# EAGLE design schema (EAGLE 7.3.0)

## Sheet 1 of 3
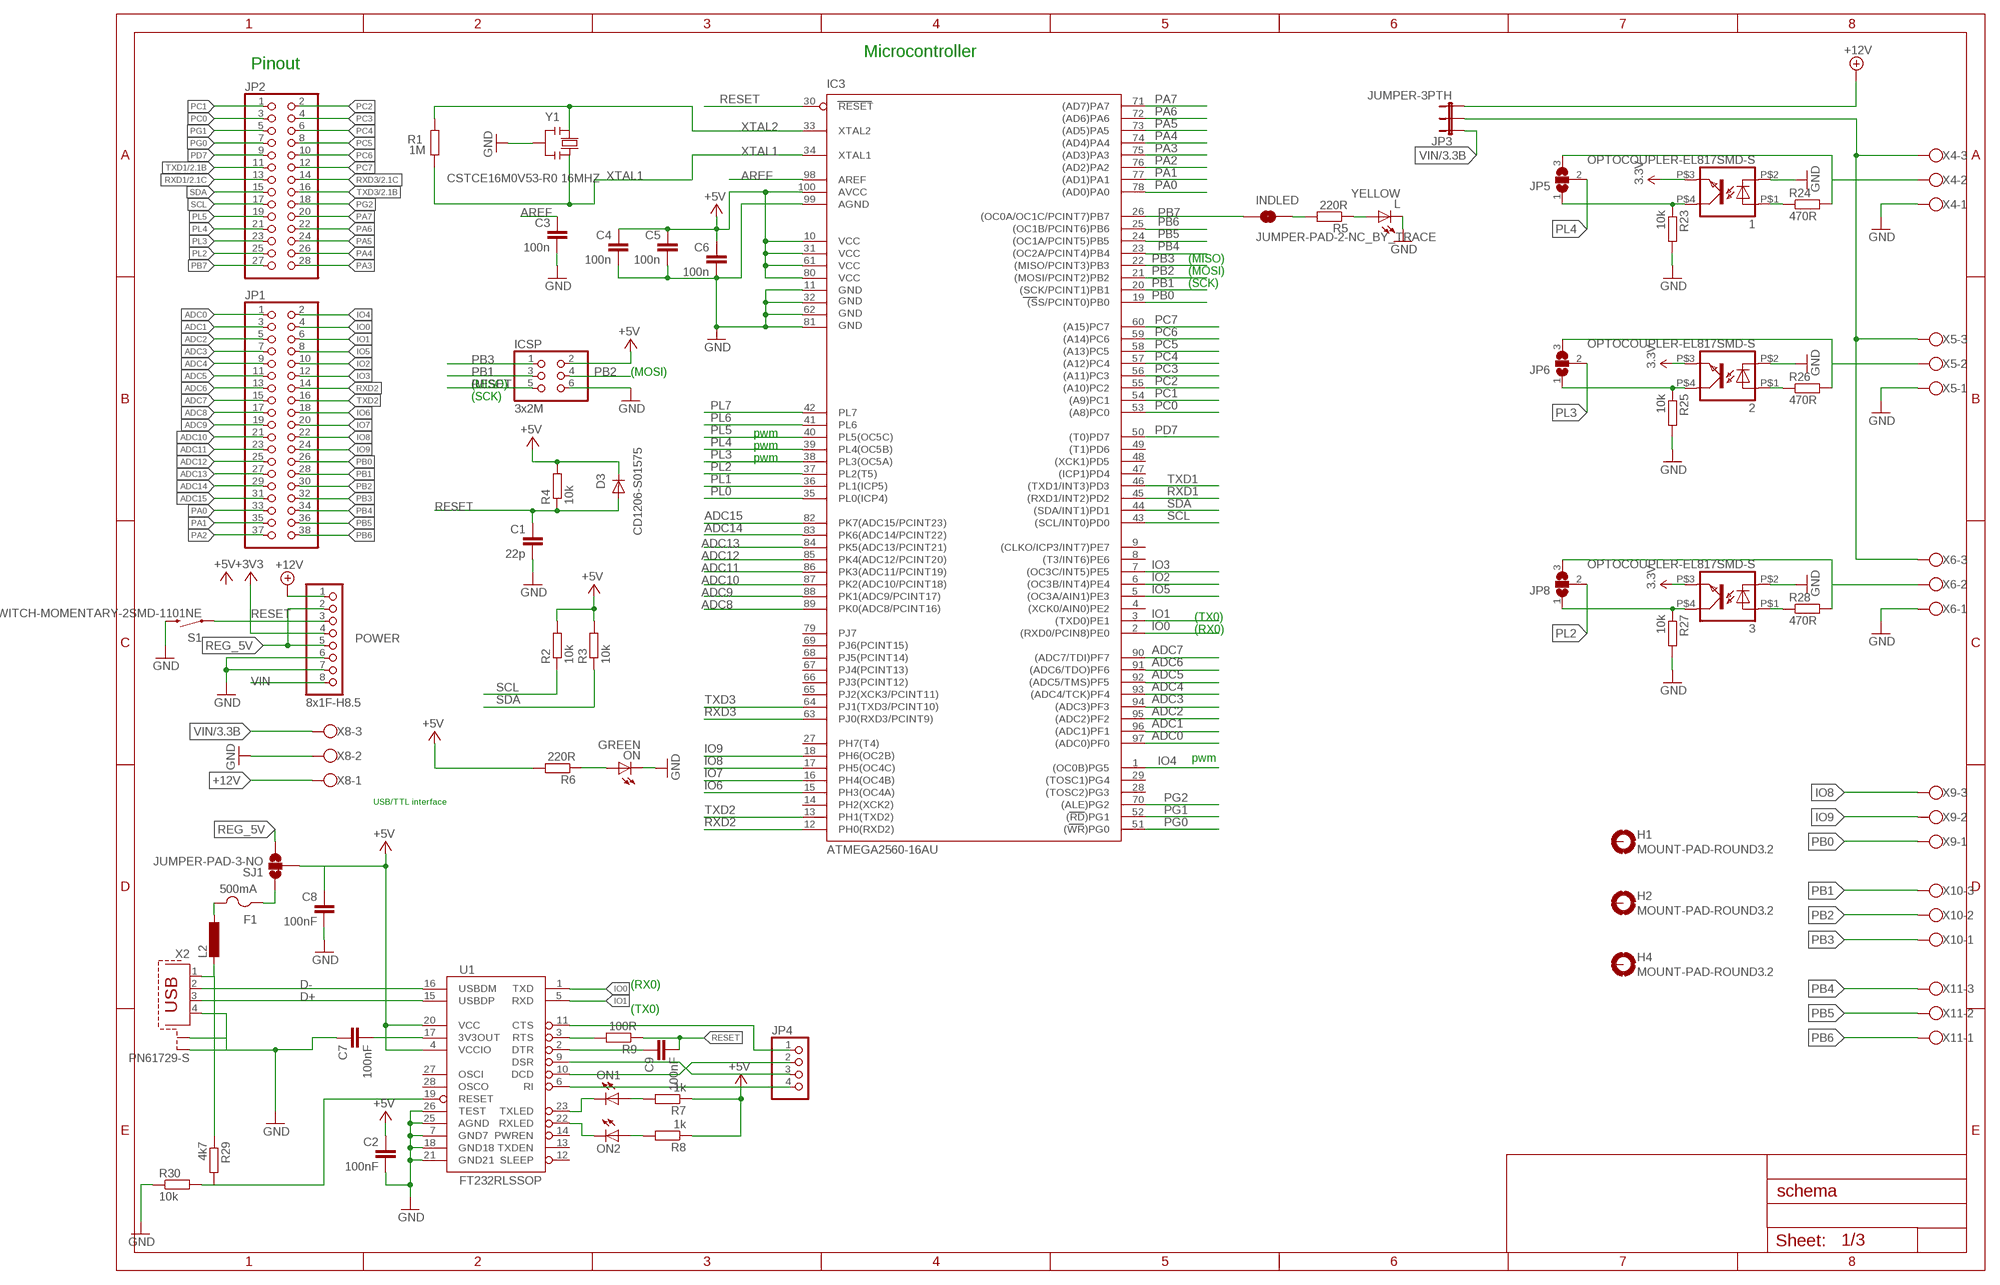
[diagram p0: schematic, sheet 1]

### Parts
1  OPTOCOUPLER-EL817SMD-S  [SMD-S]
2  OPTOCOUPLER-EL817SMD-S  [SMD-S]
3  OPTOCOUPLER-EL817SMD-S  [SMD-S]
C1  22p  C-EU0603-RND  [C0603-ROUND]
C2  100nF  C-EU0603-RND  [C0603-ROUND]
C3  100n  C-EU0603-RND  [C0603-ROUND]
C4  100n  C-EU0603-RND  [C0603-ROUND]
C5  100n  C-EU0603-RND  [C0603-ROUND]
C6  100n  C-EU0603-RND  [C0603-ROUND]
C7  100nF  C-EU0603-RND  [C0603-ROUND]
C8  100nF  C-EU0603-RND  [C0603-ROUND]
C9  100nF  C-EU0603-RND  [C0603-ROUND]
D3  CD1206-S01575  DIODE-MINIMELF  [MINIMELF]
F1  500mA  PTCFUSE-1812  [1812]
H1  MOUNT-PAD-ROUND3.2  [3,2-PAD]
H2  MOUNT-PAD-ROUND3.2  [3,2-PAD]
H4  MOUNT-PAD-ROUND3.2  [3,2-PAD]
IC3  ATMEGA2560-16AU  ATMEGA25602560-16AU  [TQFP100]
ICSP  3x2M  PINHD-2X3  [2X03]
INDLED  JUMPER-PAD-2-NC_BY_TRACE  [PAD-JUMPER-2-NC_BY_TRACE_YES_SILK]
JP1  PINHD-2X19  [2X19]
JP2  PINHD-2X14  [2X14]
JP3  JUMPER-3PTH  [1X03]
JP4  PINHD-1X4  [1X04]
JP5  SJ2W  [SJ_2]
JP6  SJ2W  [SJ_2]
JP8  SJ2W  [SJ_2]
L  YELLOW  LEDCHIP-LED0805  [CHIP-LED0805]
L2  L-EUL1812  [L1812]
ON  GREEN  LEDCHIP-LED0805  [CHIP-LED0805]
ON1  GREEN  LEDCHIP-LED0805  [CHIP-LED0805]
ON2  GREEN  LEDCHIP-LED0805  [CHIP-LED0805]
POWER  8x1F-H8.5  PINHD-1X8  [1X08]
R1  1M  R-EU_R0603  [R0603-ROUND]
R2  10k  R-EU_R0603  [R0603]
R3  10k  R-EU_R0603  [R0603]
R4  10k  R-EU_R0603  [R0603]
R5  220R  R-EU_R0603  [R0603]
R6  220R  R-EU_R0603  [R0603]
R7  1k  R-EU_R0603  [R0603]
R8  1k  R-EU_R0603  [R0603]
R9  100R  R-EU_R0603  [R0603]
R23  10k  R-EU_R0603  [R0603]
R24  470R  R-EU_R0603  [R0603]
R25  10k  R-EU_R0603  [R0603]
R26  470R  R-EU_R0603  [R0603]
R27  10k  R-EU_R0603  [R0603]
R28  470R  R-EU_R0603  [R0603]
R29  4k7  R-EU_R0603  [R0603]
R30  10k  R-EU_R0603  [R0603]
S1  SWITCH-MOMENTARY-2SMD-1101NE  [TACTILE-SWITCH-1101NE]
SJ1  JUMPER-PAD-3-NO  [PAD-JUMPER-3-NO_YES_SILK_FULL_BOX_WIDE_SPACING]
U1  FT232RLSSOP  [SSOP28DB]
X2  PN61729-S  [PN61729-S]
X4  W237-103  [W237-103]
X5  W237-103  [W237-103]
X6  W237-103  [W237-103]
X8  W237-103  [W237-103]
X9  W237-103  [W237-103]
X10  W237-103  [W237-103]
X11  W237-103  [W237-103]
Y1  CSTCE16M0V53-R0 16MHZ  RESONATORMU  [RESONATOR]

### Nets
3.3V: 1.P$3 2.P$3 3.P$3 POWER.4 ; supply symbol labelled +3V3 ; also sheet 2,3
+5V [power usb]: C2.1 C4.1 C5.1 C6.1 C8.1 D3.C IC3.10(VCC) IC3.31(VCC1) IC3.61(VCC2) IC3.80(VCC3) IC3.100(AVCC) ICSP.2 R2.2 R3.2 R4.2 R6.2 R7.1 R8.1 SJ1.2 U1.4(VCCIO) U1.20(VCC) ; also sheet 2
+12V: JP3.3 POWER.1 X8.1 ; also sheet 3
ADC0: IC3.97((ADC0)PF0) JP1.1
ADC1: IC3.96((ADC1)PF1) JP1.3
ADC2: IC3.95((ADC2)PF2) JP1.5
ADC3: IC3.94((ADC3)PF3) JP1.7
ADC4: IC3.93((ADC4/TCK)PF4) JP1.9
ADC5: IC3.92((ADC5/TMS)PF5) JP1.11
ADC6: IC3.91((ADC6/TDO)PF6) JP1.13
ADC7: IC3.90((ADC7/TDI)PF7) JP1.15
ADC8: IC3.89(PK0(ADC8/PCINT16)) JP1.17
ADC9: IC3.88(PK1(ADC9/PCINT17)) JP1.19
ADC10: IC3.87(PK2(ADC10/PCINT18)) JP1.21
ADC11: IC3.86(PK3(ADC11/PCINT19)) JP1.23
ADC12: IC3.85(PK4(ADC12/PCINT20)) JP1.25
ADC13: IC3.84(PK5(ADC13/PCINT21)) JP1.27
ADC14: IC3.83(PK6(ADC14/PCINT22)) JP1.29
ADC15: IC3.82(PK7(ADC15/PCINT23)) JP1.31
AREF: C3.1 IC3.98(AREF)
D+: U1.15(USBDP) X2.3
D-: U1.16(USBDM) X2.2
GND [gnd]: 1.P$2 2.P$2 3.P$2 C1.2 C2.2 C3.2 C4.2 C5.2 C6.2 C7.1 C8.2 IC3.11(GND) IC3.32(GND1) IC3.62(GND2) IC3.81(GND3) IC3.99(AGND) ICSP.6 L.C ON.C POWER.6 POWER.7 R23.2 R25.2 R27.2 R30.1 S1.2 U1.7(GND7) U1.18(GND18) U1.21(GND21) U1.25(AGND) U1.26(TEST) X2.4 X2.S1 X2.S2 X4.1 X5.1 X6.1 X8.2 Y1.2 ; also sheet 2,3
IO0: IC3.2((RXD0/PCIN8)PE0) JP1.4 U1.1(TXD)
IO1: IC3.3((TXD0)PE1) JP1.6 U1.5(RXD)
IO2: IC3.6((OC3B/INT4)PE4) JP1.10
IO3: IC3.7((OC3C/INT5)PE5) JP1.12
IO4: IC3.1((OC0B)PG5) JP1.2
IO5: IC3.5((OC3A/AIN1)PE3) JP1.8
IO6: IC3.15(PH3(OC4A)) JP1.18
IO7: IC3.16(PH4(OC4B)) JP1.20
IO8: IC3.17(PH5(OC4C)) JP1.22 X9.3
IO9: IC3.18(PH6(OC2B)) JP1.24 X9.2
N$1: L.A R5.1
N$2: ON1.A R7.2
N$3: ON.A R6.1
N$4: ON2.A R8.2
N$5: C7.2 U1.17(3V3OUT)
N$6: L2.2 R29.1 X2.1
N$7: ON1.C U1.23(TXLED)
N$8: ON2.C U1.22(RXLED)
N$9: R9.2 U1.3(RTS)
N$10: C9.1 U1.2(DTR)
N$11: JP4.1 U1.11(CTS)
N$12: JP4.2 U1.10(DCD)
N$13: JP4.3 U1.9(DSR)
N$14: JP4.4 U1.6(RI)
N$31: INDLED.2 R5.2
N$32: F1.2 L2.1
N$33: JP3.2 X4.3 X5.3 X6.3
N$34: 2.P$4 JP6.1 R25.1
N$35: 1.P$4 JP5.1 R23.1
N$36: JP5.3 R24.2 X4.2
N$37: 1.P$1 R24.1
N$39: JP6.3 R26.2 X5.2
N$40: 2.P$1 R26.1
N$41: R29.2 R30.2 U1.19(RESET)
N$42: 3.P$4 JP8.1 R27.1
N$43: JP8.3 R28.2 X6.2
N$44: 3.P$1 R28.1
PA0: IC3.78((AD0)PA0) JP1.33
PA1: IC3.77((AD1)PA1) JP1.35
PA2: IC3.76((AD2)PA2) JP1.37
PA3: IC3.75((AD3)PA3) JP2.28
PA4: IC3.74((AD4)PA4) JP2.26
PA5: IC3.73((AD5)PA5) JP2.24
PA6: IC3.72((AD6)PA6) JP2.22
PA7: IC3.71((AD7)PA7) JP2.20
PB0: IC3.19((SS/PCINT0)PB0) JP1.26 X9.1
PB1: IC3.20((SCK/PCINT1)PB1) ICSP.3 JP1.28 X10.3
PB2: IC3.21((MOSI/PCINT2)PB2) ICSP.4 JP1.30 X10.2
PB3: IC3.22((MISO/PCINT3)PB3) ICSP.1 JP1.32 X10.1
PB4: IC3.23((OC2A/PCINT4)PB4) JP1.34 X11.3
PB5: IC3.24((OC1A/PCINT5)PB5) JP1.36 X11.2
PB6: IC3.25((OC1B/PCINT6)PB6) JP1.38 X11.1
PB7: IC3.26((OC0A/OC1C/PCINT7)PB7) INDLED.1 JP2.27
PC0: IC3.53((A8)PC0) JP2.3
PC1: IC3.54((A9)PC1) JP2.1
PC2: IC3.55((A10)PC2) JP2.2
PC3: IC3.56((A11)PC3) JP2.4
PC4: IC3.57((A12)PC4) JP2.6
PC5: IC3.58((A13)PC5) JP2.8
PC6: IC3.59((A14)PC6) JP2.10
PC7: IC3.60((A15)PC7) JP2.12
PD7: IC3.50((T0)PD7) JP2.9
PG0: IC3.51((WR)PG0) JP2.7
PG1: IC3.52((RD)PG1) JP2.5
PG2: IC3.70((ALE)PG2) JP2.18
PL0: IC3.35(PL0(ICP4))
PL1: IC3.36(PL1(ICP5))
PL2: IC3.37(PL2(T5)) JP2.25 JP8.2
PL3: IC3.38(PL3(OC5A)) JP2.23 JP6.2
PL4: IC3.39(PL4(OC5B)) JP2.21 JP5.2
PL5: IC3.40(PL5(OC5C)) JP2.19
PL6: IC3.41(PL6)
PL7: IC3.42(PL7)
REG_5V: POWER.2 POWER.5 SJ1.3 ; also sheet 3
RESET: C1.1 C9.2 D3.A IC3.30(RESET) ICSP.5 POWER.3 R4.1 R9.1 S1.1
RXD1: IC3.45((RXD1/INT2)PD2) JP2.13 ; also sheet 2
RXD2: IC3.12(PH0(RXD2)) JP1.14
RXD3: IC3.63(PJ0(RXD3/PCINT9)) JP2.14 ; also sheet 2
SCL: IC3.43((SCL/INT0)PD0) JP2.17 R2.1
SDA: IC3.44((SDA/INT1)PD1) JP2.15 R3.1
TXD1: IC3.46((TXD1/INT3)PD3) JP2.11 ; also sheet 2
TXD2: IC3.13(PH1(TXD2)) JP1.16
TXD3: IC3.64(PJ1(TXD3/PCINT10)) JP2.16 ; also sheet 2
VIN [power]: JP3.1 POWER.8 X8.3 ; also sheet 3
VUSB: F1.1 SJ1.1
XTAL1: IC3.34(XTAL1) R1.1 Y1.3
XTAL2: IC3.33(XTAL2) R1.2 Y1.1
Unconnected: H1.B3,2(MOUNT) H2.B3,2(MOUNT) H4.B3,2(MOUNT) IC3.4((XCK0/AIN0)PE2) IC3.8((T3/INT6)PE6) IC3.9((CLKO/ICP3/INT7)PE7) IC3.14(PH2(XCK2)) IC3.27(PH7(T4)) IC3.28((TOSC2)PG3) IC3.29((TOSC1)PG4) IC3.47((ICP1)PD4) IC3.48((XCK1)PD5) IC3.49((T1)PD6) IC3.65(PJ2(XCK3/PCINT11)) IC3.66(PJ3(PCINT12)) IC3.67(PJ4(PCINT13)) IC3.68(PJ5(PCINT14)) IC3.69(PJ6(PCINT15)) IC3.79(PJ7) U1.12(SLEEP) U1.13(TXDEN) U1.14(PWREN) U1.27(OSCI) U1.28(OSCO)

### Notes on the sheet
- Microcontroller
- Pinout
- (MISO)
- (MOSI)
- (SCK)
- (MOSI)
- (MISO)
- (SCK)
- pwm
- pwm
- pwm
- (TX0)
- (RX0)
- pwm
- USB/TTL interface
- (RX0)
- (TX0)

## Sheet 2 of 3
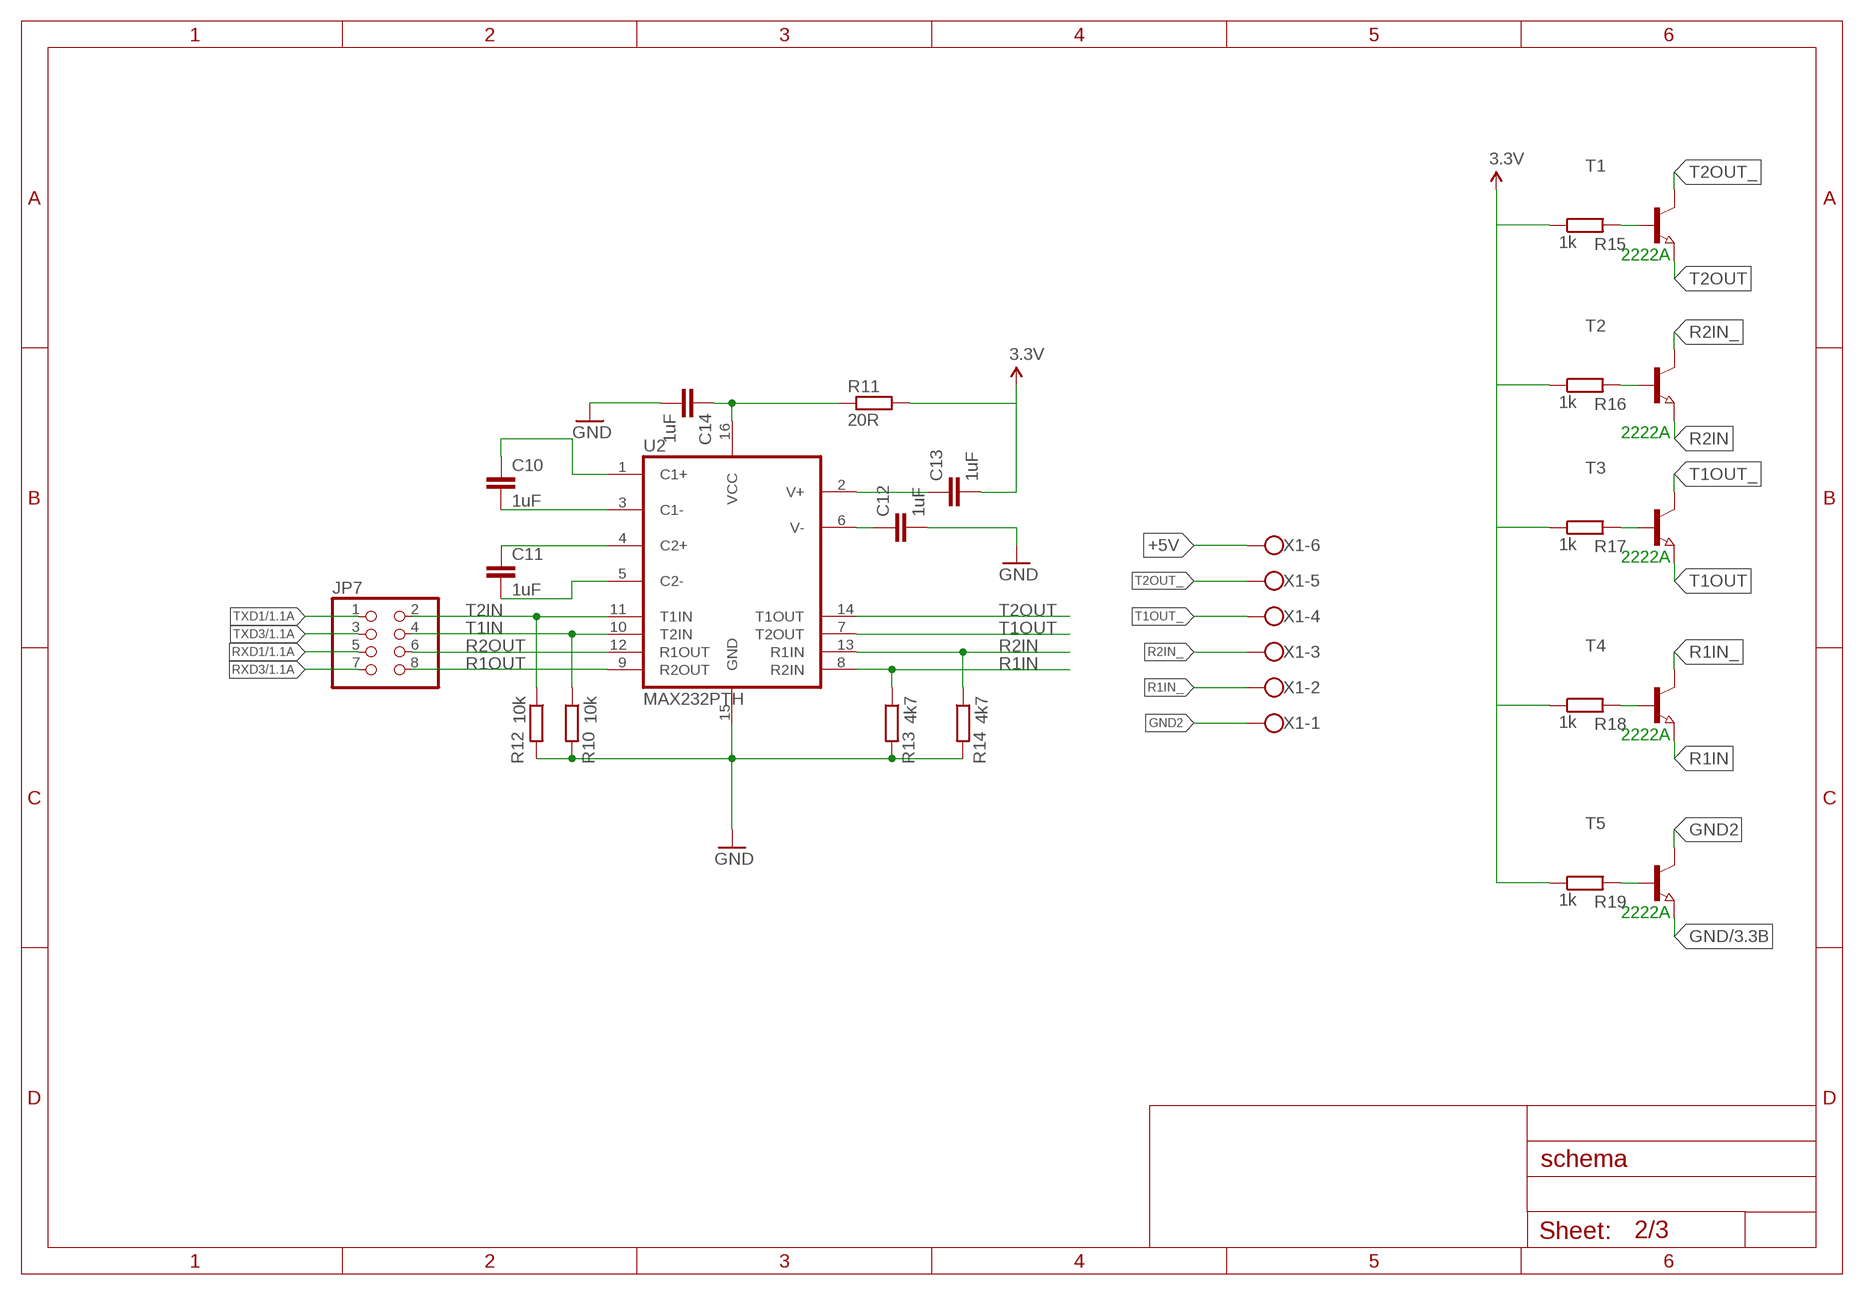
[diagram p1: schematic, sheet 2]

### Parts
C10  1uF  C-EUC0603  [C0603]
C11  1uF  C-EUC0603  [C0603]
C12  1uF  C-EUC0603  [C0603]
C13  1uF  C-EUC0603  [C0603]
C14  1uF  C-EUC0603  [C0603]
JP7  PINHD-2X4  [2X04]
R10  10k  R-EU_R0603  [R0603]
R11  20R  R-EU_R0603  [R0603]
R12  10k  R-EU_R0603  [R0603]
R13  4k7  R-EU_R0603  [R0603]
R14  4k7  R-EU_R0603  [R0603]
R15  1k  R-EU_R0603  [R0603]
R16  1k  R-EU_R0603  [R0603]
R17  1k  R-EU_R0603  [R0603]
R18  1k  R-EU_R0603  [R0603]
R19  1k  R-EU_R0603  [R0603]
T1  NPN-TRANSISTOR_SOT23  [SOT23]
T2  NPN-TRANSISTOR_SOT23  [SOT23]
T3  NPN-TRANSISTOR_SOT23  [SOT23]
T4  NPN-TRANSISTOR_SOT23  [SOT23]
T5  NPN-TRANSISTOR_SOT23  [SOT23]
U2  MAX232PTH  [DIL16]
X1  W237-6  [W237-6]

### Nets
3.3V: C13.2 R11.2 R15.1 R16.1 R17.1 R18.1 R19.1 ; also sheet 1,3
+5V [power usb]: X1.6 ; also sheet 1
GND [gnd]: C12.2 C14.2 R10.2 R12.2 R13.2 R14.2 T5.2(E) U2.15(GND) ; also sheet 1,3
GND2: T5.3(C) X1.1
N$15: C10.2 U2.3(C1-)
N$16: C10.1 U2.1(C1+)
N$17: C11.2 U2.5(C2-)
N$18: C11.1 U2.4(C2+)
N$19: C12.1 U2.6(V-)
N$20: C14.1 R11.1 U2.16(VCC)
N$21: C13.1 U2.2(V+)
N$22: R15.2 T1.1(B)
N$23: R16.2 T2.1(B)
N$24: R17.2 T3.1(B)
N$25: R18.2 T4.1(B)
N$26: R19.2 T5.1(B)
R1IN: R13.1 T4.2(E) U2.8(R2IN)
R1IN_: T4.3(C) X1.2
R1OUT: JP7.8 U2.9(R2OUT)
R2IN: R14.1 T2.2(E) U2.13(R1IN)
R2IN_: T2.3(C) X1.3
R2OUT: JP7.6 U2.12(R1OUT)
RXD1: JP7.5 ; also sheet 1
RXD3: JP7.7 ; also sheet 1
T1IN: JP7.4 R10.1 U2.10(T2IN)
T1OUT: T3.2(E) U2.7(T2OUT)
T1OUT_: T3.3(C) X1.4
T2IN: JP7.2 R12.1 U2.11(T1IN)
T2OUT: T1.2(E) U2.14(T1OUT)
T2OUT_: T1.3(C) X1.5
TXD1: JP7.1 ; also sheet 1
TXD3: JP7.3 ; also sheet 1

### Notes on the sheet
- 2222A
- 2222A
- 2222A
- 2222A
- 2222A

## Sheet 3 of 3
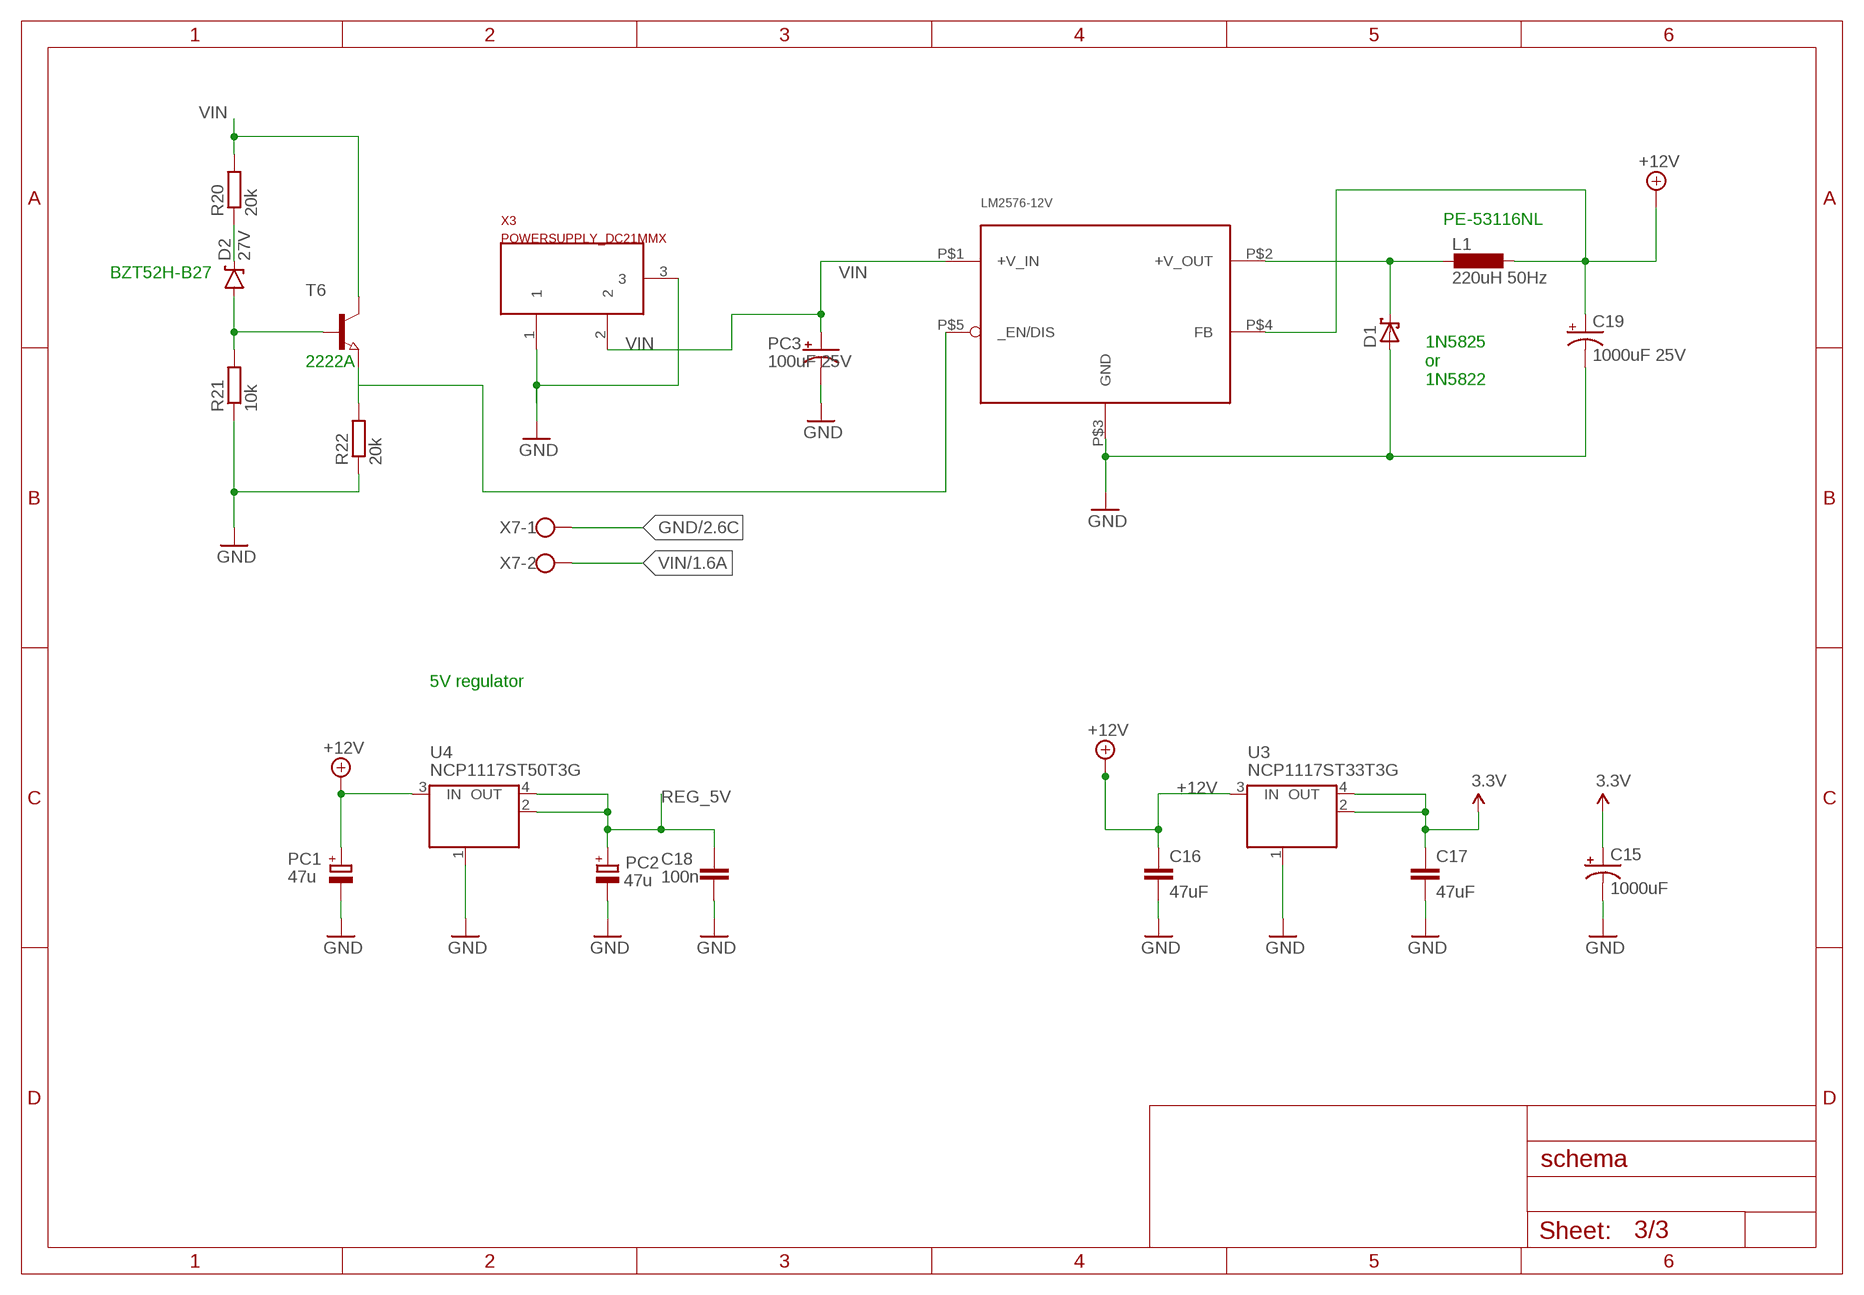
[diagram p2: schematic, sheet 3]

### Parts
C15  1000uF  CPOL-USE5-6  [E5-6]
C16  47uF  C-EUC0603  [C0603]
C17  47uF  C-EUC0603  [C0603]
C18  100n  C-EU0603-RND  [C0603-ROUND]
C19  1000uF 25V  CPOL-USE5-6  [E5-6]
D1  1N5908  [C4111-15]
D2  27V  DIODE-ZENER16V  [SOD-123]
L1  220uH 50Hz  L-KM4.0  [KM-4.0]
LM2576-12V  LM2576-T05D  [TO220-5_STAGGERED]
PC1  47u  CPOL-EUD  [PANASONIC_D]
PC2  47u  CPOL-EUD  [PANASONIC_D]
PC3  100uF 25V  CPOL-USE5-6  [E5-6]
R20  20k  R-EU_R0603  [R0603]
R21  10k  R-EU_R0603  [R0603]
R22  20k  R-EU_R0603  [R0603]
T6  NPN-TRANSISTOR_SOT23  [SOT23]
U3  NCP1117ST33T3G  MC33269ST-3.3T3  [SOT223]
U4  NCP1117ST50T3G  MC33269ST-3.3T3  [SOT223]
X3  POWERSUPPLY_DC21MMX  [POWERSUPPLY_DC-21MM]
X7  W237-102  [W237-102]

### Nets
3.3V: C15.+ C17.1 U3.2(OUT) U3.4(OUT) ; also sheet 1,2
+12V: C16.1 C19.+ L1.P$2 LM2576-12V.P$4(FB) PC1.+ U3.3(IN) U4.3(IN) ; also sheet 1
GND [gnd]: C15.- C16.2 C17.2 C18.1 C19.- D1.A LM2576-12V.P$3(GND) PC1.- PC2.- PC3.- R21.1 R22.1 U3.1(GND/ADJ) U4.1(GND/ADJ) X3.1 X3.3 X7.1 ; also sheet 1,2
N$27: D1.C L1.P$1 LM2576-12V.P$2(+V_OUT)
N$28: D2.A R21.2 T6.1(B)
N$29: D2.C R20.1
N$30 [gnd]: LM2576-12V.P$5(_EN/DIS) R22.2 T6.2(E)
REG_5V: C18.2 PC2.+ U4.2(OUT) U4.4(OUT) ; also sheet 1
VIN [power]: LM2576-12V.P$1(+V_IN) PC3.+ R20.2 T6.3(C) X3.2 X7.2 ; also sheet 1

### Notes on the sheet
- PE-53116NL
- BZT52H-B27
- 2222A
- 1N5825
  or
  1N5822
- 5V regulator

## Library data of the parts
1-3 = EL817:OPTOCOUPLER-EL817
C1-C9 C18 = SmartPrj:C-EU: CAPACITOR, European symbol
C10-C14 C16 C17 = rcl:C-EU: CAPACITOR, European symbol
C15 C19 PC3 = adafruit:CPOL-US: POLARIZED CAPACITOR, American symbol
D1 = diode:1N5908: DIODE schottky
D2 = SparkFun-DiscreteSemi:DIODE-ZENER: Zener Diode Production Part - 8199 3.4V Zener Voltage; PROD_ID: DIO-12440; VALUE: 16V
D3 = diode:DIODE-: DIODE
F1 = adafruit:PTCFUSE: PTC fuses, resettable thermistors
H1 H2 H4 = holes:MOUNT-PAD-ROUND: MOUNTING PAD, round
IC3 = SmartPrj:ATMEGA2560: MICROCONTROLLER 64/128/256 Kbytes FLASH 4 Kbytes EEPROM 8 Kbytes SRAM 86 General Purpose I/O pins 12-channels16-bit PWM 4 x Serial USARTs 16-channels 10-bit A/D
ICSP = SmartPrj:PINHD-2X3: PIN HEADER
INDLED = SparkFun-Passives:JUMPER-PAD-2-NC_BY_TRACE
JP1 = pinhead:PINHD-2X19: PIN HEADER
JP2 = pinhead:PINHD-2X14: PIN HEADER
JP3 = SparkFun-Retired:JUMPER-3
JP4 = pinhead:PINHD-1X4: PIN HEADER
JP5 JP6 JP8 = jumper:SJ2W: SMD solder JUMPER
JP7 = adafruit:PINHD-2X4: PIN HEADER
L ON ON1 ON2 = led:LED: LED OSRAM: - CHIPLED LG R971, LG N971, LY N971, LG Q971, LY Q971, LO R971, LY R971 LH N974, LH R974 LS Q976, LO Q976, LY Q976 LO Q996 - Hyper CHIPLED LW Q18S LB Q993, LB Q99A, LB R99A - SideLED LS A670, LO A670, LY A670, LG A670, LP A670 LB A673, LV A673, LT A673, LW A673 LH A674 LY A675 LS A676, LA A676, LO A676, LY A676, LW A676 LS A679, LY A679, LG A679 - Hyper Micro SIDELED® LS Y876, LA Y876, LO Y876, LY Y876 LT Y87S - SmartLED LW L88C, LW L88S LB L89C, LB L89S, LG L890 LS L89K, LO L89K, LY L89K LS L896, LA L896, LO L896, LY L896 - TOPLED LS T670, LO T670, LY T670, LG T670, LP T670 LSG T670, LSP T670, LSY T670, LOP T670, LYG T670 LG T671, LOG T671, LSG T671 LB T673, LV T673, LT T673, LW T673 LH T674 LS T676, LA T676, LO T676, LY T676, LB T676, LH T676, LSB T676, LW T676 LB T67C, LV T67C, LT T67C, LS T67K, LO T67K, LY T67K, LW E67C LS E67B, LA E67B, LO E67B, LY E67B, LB E67C, LV E67C, LT E67C LW T67C LS T679, LY T679, LG T679 LS T770, LO T770, LY T770, LG T770, LP T770 LB T773, LV T773, LT T773, LW T773 LH T774 LS E675, LA E675, LY E675, LS T675 LS T776, LA T776, LO T776, LY T776, LB T776 LHGB T686 LT T68C, LB T68C - Hyper Mini TOPLED® LB M676 - Mini TOPLED Santana® LG M470 LS M47K, LO M47K, LY M47K Source: http://www.osram.convergy.de/
L1 = inductor_Noyle:L-KM4.0
L2 = rcl:L-EU: INDUCTOR, European symbol
LM2576-12V = LM2576:LM2576-T05D: LM2576/LM2576HV Series SIMPLE SWITCHER® 3A Step-Down Voltage Regulator STAGGERED PACKAGE
PC1 PC2 = rcl:CPOL-EU: POLARIZED CAPACITOR, European symbol
POWER = SmartPrj:PINHD-1X8: PIN HEADER
R1 = SmartPrj:R-EU_: RESISTOR, European symbol
R2-R9 R23-R30 = resistor:R-EU_: RESISTOR, European symbol
R10-R22 = rcl:R-EU_: RESISTOR, European symbol
S1 = SparkFun-Electromechanical:SWITCH-MOMENTARY-2: Various NO switches- pushbuttons, reed, etc; PROD_ID: SWCH-00815
SJ1 = SparkFun-Passives:JUMPER-PAD-3-NO
T1-T6 = semicon-smd-ipc:NPN-TRANSISTOR_: NPN TRANSISTOR
U1 = SparkFun-DigitalIC:FT232RL: USB UART FT232RL 4th Generation USB UART (USB <-> Serial) Controller. Spark Fun Electronics SKU : COM-00650 Production SKU IC-00870; PROD_ID: IC-00870
U2 = SparkFun-DigitalIC:MAX232: RS232 Transceiver Very common IC. This is generically called 'MAX232', but works with the 3V equivalent MAX3232 generic ICs. Field tested and mother approved. Spark Fun Electronics SKU : COM-00316 (DIP) and COM-00589 (SMD)
U3 U4 = linear:MC33269ST*: Adjustable Output Low Dropout Voltage Regulator 800 mA Source: http://www.onsemi.com/pub/Collateral/MC33269-D.PDF
X1 = con-wago-500:W237-6: WAGO SCREW CLAMP; OC_FARNELL: unknown; OC_NEWARK: unknown
X2 = con-berg:PN61729-S: BERG USB connector; OC_FARNELL: unknown; OC_NEWARK: unknown
X3 = SmartPrj:POWERSUPPLY_DC21MM
X4-X6 X8-X11 = con-wago-500:W237-103: WAGO SCREW CLAMP; MPN: 237-103; OC_FARNELL: unknown; OC_NEWARK: 18M7116
X7 = con-wago-500:W237-102: WAGO SCREW CLAMP; MPN: 237-102; OC_FARNELL: unknown; OC_NEWARK: 70K9898
Y1 = SmartPrj:RESONATOR

## Net classes
1 power: width 0.152 mm, drill 0.152 mm, clearance 0.152 mm
2 gnd: width 0.152 mm, drill 0.152 mm, clearance 0.152 mm
3 power usb: width 0.152 mm, drill 0.152 mm, clearance 0.152 mm

## Board
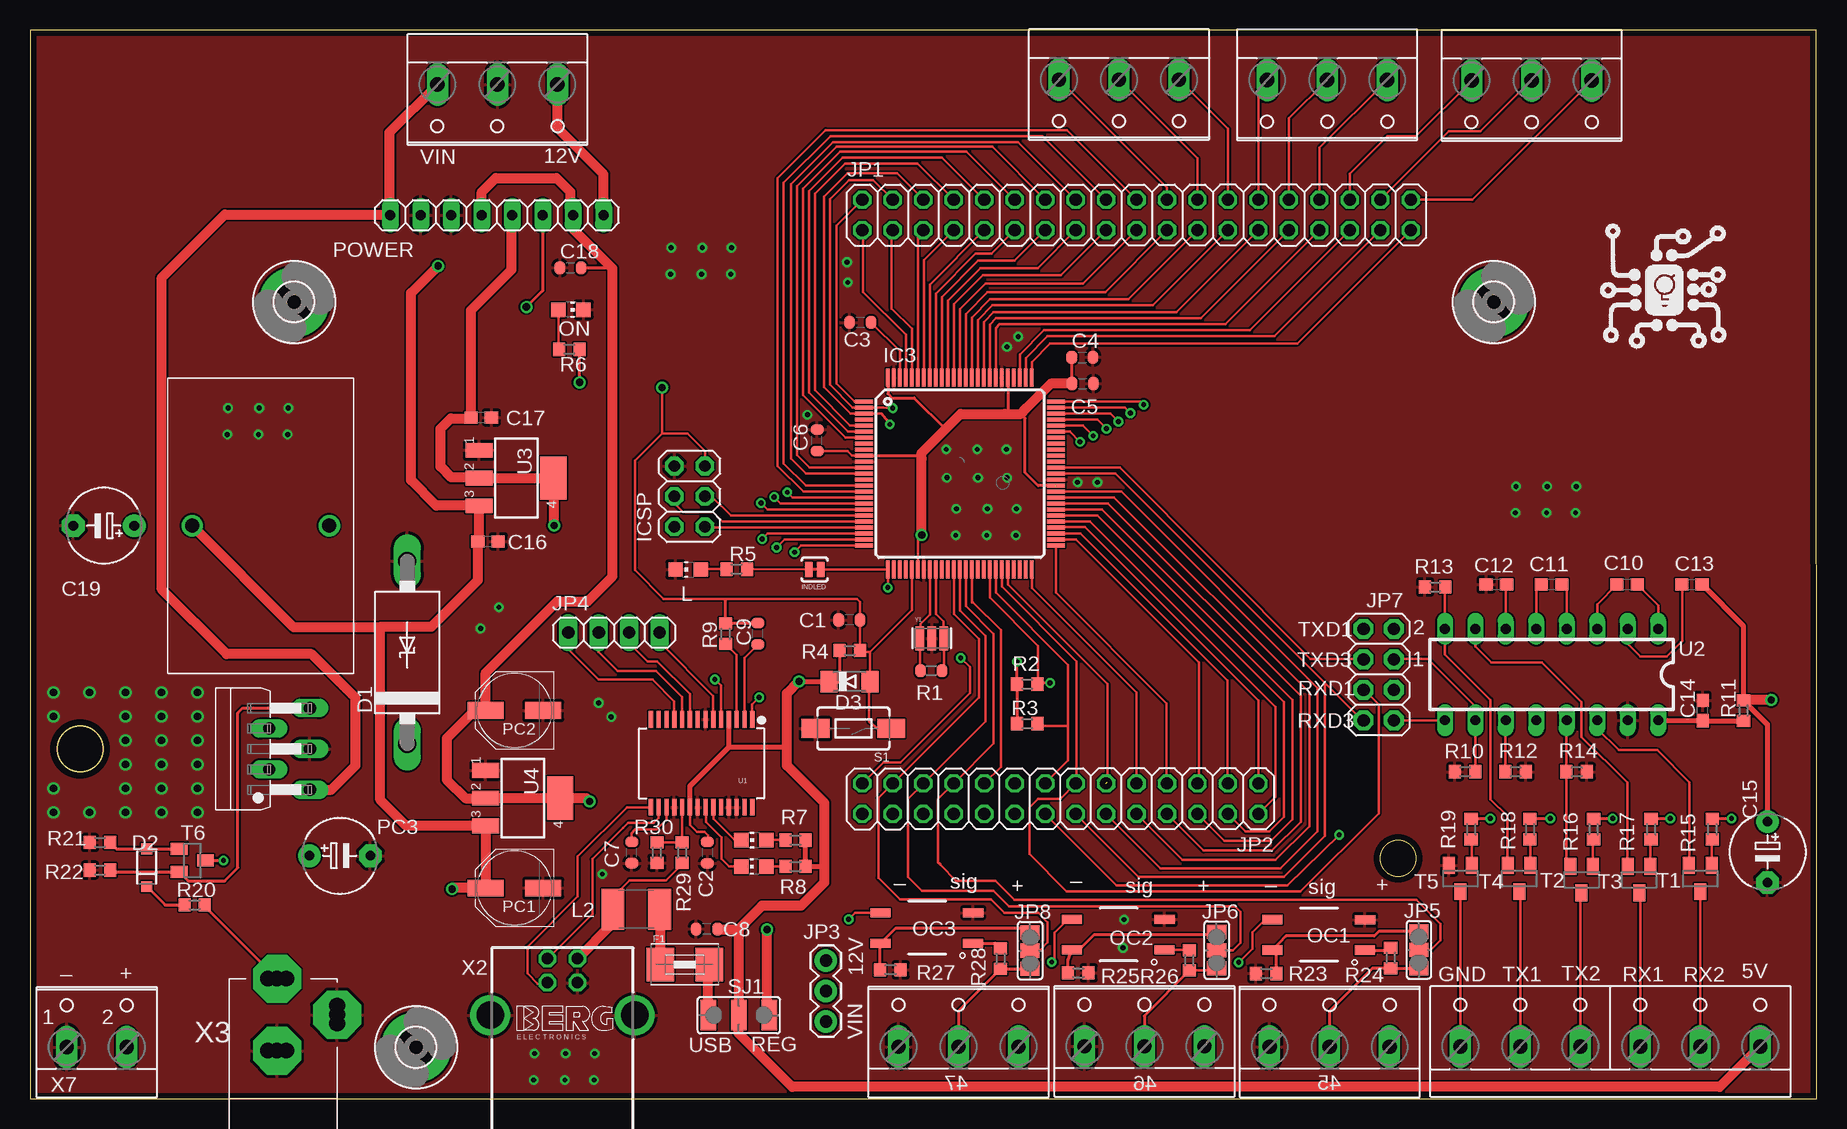
[diagram p3: board, top side]
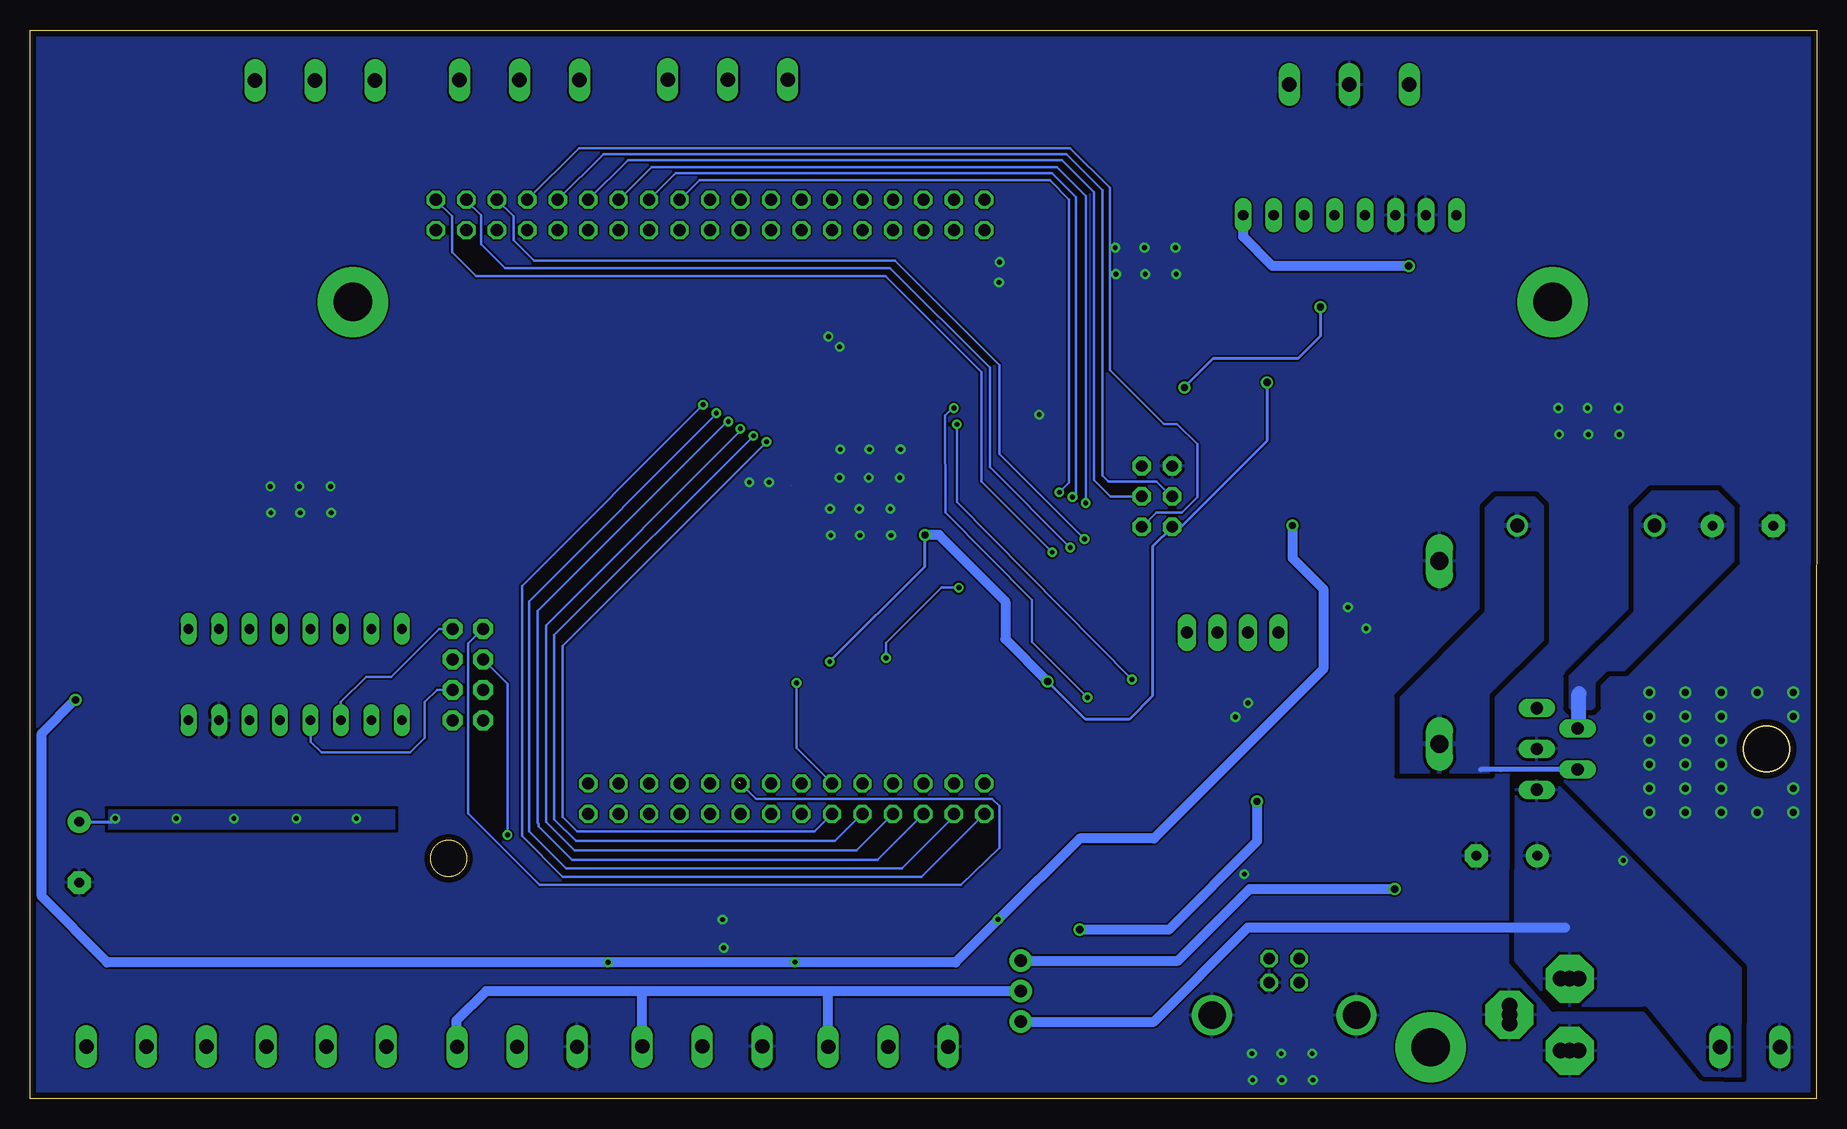
[diagram p4: board, bottom side, seen from below]

Size 148.93 x 89.1 mm. Coordinates in mm from the lower left corner, seen from the top.
Outline: 0.03,0 148.93,0 148.9,89.1 0,89.1 0.03,0
Outline: circle at 114.04,20.03 radius 1.5
Copper layers (1*16): Top 0.035mm / dielectric 1.5mm / Bottom 0.035mm
Design rules "default *": minimum track width 6mil, minimum drill 12mil, track to track 6mil, track to pad 6mil, pad to pad 6mil, via to via 6mil, smd to smd 0mil, copper to edge 20mil, drill to drill 6mil, minimum pad ring 10mil, minimum via ring 8mil, stop-mask expansion 4mil, vias tented up to drill 0mil, thermal gap 10mil
bRestrict: 36 lines

### Footprints (pad centres in the part's own frame; a part is rotated, then mirrored left to right if it is on the bottom)
SMD-S = smd 1.68 x 0.76: P$1 -3.855,1.27; P$2 -3.87,-1.265; P$3 3.855,-1.27; P$4 3.855,1.27
C0603-ROUND = smd 0.898 x 1.1: 1 -0.889,0; 2 0.889,0
C0603 = smd 1.1 x 1: 1 -0.85,0; 2 0.85,0
E5-6 = drill 0.813 pad 1.905: + -2.54,0 | drill 0.813 pad 1.905 octagon: - 2.54,0
C4111-15 = drill 1.499 long: A 7.62,0; C -7.62,0
SOD-123 = smd 0.9 x 0.95: A 1.575,0; C -1.575,0
MINIMELF = smd 1.4 x 1.8: A 1.7,0; C -1.7,0
1812 = smd 2.286 x 2.794: 1 -2.046,0; 2 2.046,0
3,2-PAD = drill 3.2 pad 5.842: B3,2 0,0
TQFP100 = smd 1.5 x 0.3: 1 -8,6; 2 -8,5.5; 3 -8,5; 4 -8,4.5; 5 -8,4; 6 -8,3.5; 7 -8,3; 8 -8,2.5; 9 -8,2; 10 -8,1.5; 11 -8,1; 12 -8,0.5; 13 -8,0; 14 -8,-0.5; 15 -8,-1; 16 -8,-1.5; 17 -8,-2; 18 -8,-2.5; 19 -8,-3; 20 -8,-3.5; 21 -8,-4; 22 -8,-4.5; 23 -8,-5; 24 -8,-5.5; 25 -8,-6; 51 8,-6; 52 8,-5.5; 53 8,-5; 54 8,-4.5; 55 8,-4; 56 8,-3.5; 57 8,-3; 58 8,-2.5; 59 8,-2; 60 8,-1.5; 61 8,-1; 62 8,-0.5; 63 8,0; 64 8,0.5; 65 8,1; 66 8,1.5; 67 8,2; 68 8,2.5; 69 8,3; 70 8,3.5; 71 8,4; 72 8,4.5; 73 8,5; 74 8,5.5; 75 8,6 | smd 0.3 x 1.5: 26 -6,-8; 27 -5.5,-8; 28 -5,-8; 29 -4.5,-8; 30 -4,-8; 31 -3.5,-8; 32 -3,-8; 33 -2.5,-8; 34 -2,-8; 35 -1.5,-8; 36 -1,-8; 37 -0.5,-8; 38 0,-8; 39 0.5,-8; 40 1,-8; 41 1.5,-8; 42 2,-8; 43 2.5,-8; 44 3,-8; 45 3.5,-8; 46 4,-8; 47 4.5,-8; 48 5,-8; 49 5.5,-8; 50 6,-8; 76 6,8; 77 5.5,8; 78 5,8; 79 4.5,8; 80 4,8; 81 3.5,8; 82 3,8; 83 2.5,8; 84 2,8; 85 1.5,8; 86 1,8; 87 0.5,8; 88 0,8; 89 -0.5,8; 90 -1,8; 91 -1.5,8; 92 -2,8; 93 -2.5,8; 94 -3,8; 95 -3.5,8; 96 -4,8; 97 -4.5,8; 98 -5,8; 99 -5.5,8; 100 -6,8
2X03 = drill 0.95 pad 1.55 octagon: 1 -2.54,-1.27; 2 -2.54,1.27; 3 0,-1.27; 4 0,1.27; 5 2.54,-1.27; 6 2.54,1.27
PAD-JUMPER-2-NC_BY_TRACE_YES_SILK = smd 0.635 x 1.27: 1 -0.508,0; 2 0.508,0
2X19 = drill 1.016 octagon: 1 -22.86,-1.27; 2 -22.86,1.27; 3 -20.32,-1.27; 4 -20.32,1.27; 5 -17.78,-1.27; 6 -17.78,1.27; 7 -15.24,-1.27; 8 -15.24,1.27; 9 -12.7,-1.27; 10 -12.7,1.27; 11 -10.16,-1.27; 12 -10.16,1.27; 13 -7.62,-1.27; 14 -7.62,1.27; 15 -5.08,-1.27; 16 -5.08,1.27; 17 -2.54,-1.27; 18 -2.54,1.27; 19 0,-1.27; 20 0,1.27; 21 2.54,-1.27; 22 2.54,1.27; 23 5.08,-1.27; 24 5.08,1.27; 25 7.62,-1.27; 26 7.62,1.27; 27 10.16,-1.27; 28 10.16,1.27; 29 12.7,-1.27; 30 12.7,1.27; 31 15.24,-1.27; 32 15.24,1.27; 33 17.78,-1.27; 34 17.78,1.27; 35 20.32,-1.27; 36 20.32,1.27; 37 22.86,-1.27; 38 22.86,1.27
2X14 = drill 1.016 octagon: 1 -16.51,-1.27; 2 -16.51,1.27; 3 -13.97,-1.27; 4 -13.97,1.27; 5 -11.43,-1.27; 6 -11.43,1.27; 7 -8.89,-1.27; 8 -8.89,1.27; 9 -6.35,-1.27; 10 -6.35,1.27; 11 -3.81,-1.27; 12 -3.81,1.27; 13 -1.27,-1.27; 14 -1.27,1.27; 15 1.27,-1.27; 16 1.27,1.27; 17 3.81,-1.27; 18 3.81,1.27; 19 6.35,-1.27; 20 6.35,1.27; 21 8.89,-1.27; 22 8.89,1.27; 23 11.43,-1.27; 24 11.43,1.27; 25 13.97,-1.27; 26 13.97,1.27; 27 16.51,-1.27; 28 16.51,1.27
1X03 = drill 1.016 pad 1.88: 1 0,0; 2 2.54,0; 3 5.08,0
1X04 = drill 1.016 long: 1 -3.81,0; 2 -1.27,0; 3 1.27,0; 4 3.81,0
SJ_2 = smd 1.168 x 1.6: 1 -1.524,0; 2 0,0; 3 1.524,0
2X04 = drill 1.016 pad 1.676 octagon: 1 -3.81,-1.27; 2 -3.81,1.27; 3 -1.27,-1.27; 4 -1.27,1.27; 5 1.27,-1.27; 6 1.27,1.27; 7 3.81,-1.27; 8 3.81,1.27
CHIP-LED0805 = smd 1.2 x 1.2: A 0,-1.05; C 0,1.05
KM-4.0 = drill 1.143 pad 1.778: P$1 -5.715,0; P$2 5.715,0
L1812 = smd 1.9 x 3.4: 1 -1.95,0; 2 1.95,0
TO220-5_STAGGERED = drill 1.016 long: P$1 -3.396,-3.404; P$2 -1.7,-0.002; P$3 0.004,-3.4; P$4 1.7,0.002; P$5 3.404,-3.396
PANASONIC_D = smd 3 x 1.4: + 2.4,0; - -2.4,0
1X08 = drill 0.85 pad 1.422 long: 1 -8.89,0; 2 -6.35,0; 3 -3.81,0; 4 -1.27,0; 5 1.27,0; 6 3.81,0; 7 6.35,0; 8 8.89,0
R0603-ROUND = smd 0.898 x 1.1: 1 -0.889,0; 2 0.889,0
R0603 = smd 1 x 1.1: 1 -0.85,0; 2 0.85,0
TACTILE-SWITCH-1101NE = smd 2.3 x 1.6: 1 -3.15,0; 2 3.15,0
PAD-JUMPER-3-NO_YES_SILK_FULL_BOX_WIDE_SPACING = smd 1.27 x 2.54: 1 -2.54,0; 2 0,0; 3 2.54,0
SOT23 = smd 1 x 1.4: 1 -0.95,-1.1; 2 0.95,-1.1; 3 0,1.1
SSOP28DB = smd 0.348 x 1.397: 1 -4.225,-3.656; 2 -3.575,-3.656; 3 -2.925,-3.656; 4 -2.275,-3.656; 5 -1.625,-3.656; 6 -0.975,-3.656; 7 -0.325,-3.656; 8 0.325,-3.656; 9 0.975,-3.656; 10 1.625,-3.656; 11 2.275,-3.656; 12 2.925,-3.656; 13 3.575,-3.656; 14 4.225,-3.656; 15 4.225,3.656; 16 3.575,3.656; 17 2.925,3.656; 18 2.275,3.656; 19 1.625,3.656; 20 0.975,3.656; 21 0.325,3.656; 22 -0.325,3.656; 23 -0.975,3.656; 24 -1.625,3.656; 25 -2.275,3.656; 26 -2.925,3.656; 27 -3.575,3.656; 28 -4.225,3.656
DIL16 = drill 0.813 long: 1 -8.89,-3.81; 2 -6.35,-3.81; 3 -3.81,-3.81; 4 -1.27,-3.81; 5 1.27,-3.81; 6 3.81,-3.81; 7 6.35,-3.81; 8 8.89,-3.81; 9 8.89,3.81; 10 6.35,3.81; 11 3.81,3.81; 12 1.27,3.81; 13 -1.27,3.81; 14 -3.81,3.81; 15 -6.35,3.81; 16 -8.89,3.81
SOT223 = smd 1.219 x 2.235: 1 -2.311,-3.099; 2 0,-3.099; 3 2.311,-3.099 | smd 3.6 x 2.2: 4 0,3.099
W237-6 = drill 1.194 long: 1 -12.5,-1.27; 2 -7.5,-1.27; 3 -2.5,-1.27; 4 2.5,-1.27; 5 7.5,-1.27; 6 12.5,-1.27
PN61729-S = drill 0.95 octagon: 1 1.25,4.71; 2 -1.25,4.71; 3 -1.25,2.71; 4 1.25,2.71 | drill 2.3 pad 2.9: S1 -6.02,0; S2 6.02,0
POWERSUPPLY_DC-21MM = drill 1.3 pad 4 octagon: 1 -5.08,-3.353; 2 -0.076,-6.35; 3 -0.076,-0.356 | drill 1.3: 4 -5.08,-4.115; 5 -5.08,-2.591; 6 -0.838,-0.356; 7 0.686,-0.356; 8 -0.838,-6.35; 9 0.686,-6.35
W237-103 = drill 1.194 long: 1 -5,-1.29; 2 0,-1.29; 3 5,-1.29
W237-102 = drill 1.194 long: 1 -2.5,-1.27; 2 2.5,-1.27
RESONATOR = smd 0.7 x 2: 1 -1,0; 2 0,0; 3 1,0

### Placement (x,y rotation side)
1  107.42,13.66 180 top
2  90.71,13.69 180 top
3  74.75,14.24 180 top
C1  68.3,39.91 180 top
C2  56.46,20.51 270 top
C3  69.21,64.71 180 top
C4  87.72,61.81 0 top
C5  87.75,59.62 0 top
C6  65.61,54.89 90 top
C7  50.16,20.53 90 top
C8  56.42,14.15 180 top
C9  60.68,38.76 90 top
C10  133.13,42.86 180 top
C11  126.83,42.86 180 top
C12  122.23,42.86 180 top
C13  138.53,42.86 0 top
C14  139.43,32.36 90 top
C15  144.83,20.56 270 top
C16  38.18,46.46 0 top
C17  37.61,56.8 0 top
C18  45.06,69.27 0 top
C19  6.15,47.77 180 top
D1  31.45,37.2 90 top
D2  9.73,19.26 90 top
D3  68.31,34.78 0 top
F1  54.58,11.19 180 top
H1  32.18,4.29 0 top
H2  22.01,66.42 0 top
H4  122.01,66.42 0 top
IC3  77.5,52.12 0 top
ICSP  54.99,50.21 90 top
INDLED  65.41,44.12 180 top
JP1  92.24,73.68 0 top
JP2  85.89,25.01 180 top
JP3  66.35,6.43 90 top
JP4  48.68,38.86 0 top
JP5  115.77,12.41 270 top
JP6  98.91,12.39 270 top
JP7  112.43,35.36 270 top
JP8  83.36,12.35 270 top
L  54.86,44.12 90 top
L1  19.23,47.78 180 top
L2  50.53,15.79 180 top
LM2576-12V  19.93,29.16 90 top
ON  45.08,65.78 270 top
ON1  60.34,21.56 90 top
ON2  60.33,19.36 90 top
PC1  40.39,17.56 180 top
PC2  40.39,32.36 180 top
PC3  25.83,20.26 0 top
POWER  38.92,73.66 180 top
R1  75.13,35.69 180 top
R2  83.13,34.56 180 top
R3  83.13,31.26 180 top
R4  68.33,37.36 180 top
R5  58.9,44.15 0 top
R6  44.96,62.48 0 top
R7  63.81,21.56 180 top
R8  63.81,19.36 180 top
R9  57.98,38.76 270 top
R10  119.63,27.26 180 top
R11  142.83,32.36 90 top
R12  123.83,27.26 0 top
R13  117.13,42.66 180 top
R14  128.93,27.26 0 top
R15  140.23,22.46 270 top
R16  130.33,22.46 270 top
R17  135.13,22.46 270 top
R18  125.03,22.46 270 top
R19  120.13,22.46 270 top
R20  13.73,16.16 0 top
R21  5.83,21.36 0 top
R22  5.83,19.06 0 top
R23  103.05,10.44 180 top
R24  113.42,11.74 270 top
R25  87.39,10.49 0 top
R26  96.64,11.54 270 top
R27  71.72,10.75 0 top
R28  80.9,11.67 270 top
R29  54.36,20.52 90 top
R30  52.26,20.52 90 top
S1  68.63,30.86 180 top
SJ1  59.08,6.96 0 top
T1  139.23,18.36 180 top
T2  129.33,18.26 180 top
T3  134.13,18.26 180 top
T4  124.13,18.36 180 top
T5  119.23,18.36 180 top
T6  13.53,19.86 270 top
U1  55.98,27.96 180 top
U2  126.83,35.36 180 top
U3  40.53,51.75 270 top
U4  41.09,25.06 270 top
X1  131.73,5.63 0 top
X2  44.38,6.96 0 top
X3  20.52,3.66 180 top
X4  108.33,5.62 0 top
X5  92.89,5.66 0 top
X6  77.4,5.62 0 top
X7  5.56,5.57 0 top
X8  38.96,83.26 180 top
X9  90.77,83.67 180 top
X10  108.13,83.64 180 top
X11  125.17,83.6 180 top
Y1  75.18,38.39 0 top

### Tracks (layer width: path | path; a pad name or v marks a point on that pad's centre or on a via)
3.3V  (via drill 0.4, 0.6)
  Top 0.203: v85.17,11.4 85.38,11.61 85.38,13.84 86.5,14.96 2.P$3 | 3.P$3 68.79,15.51 v68.24,14.96 | v100.75,11.36 101.9,12.51 101.9,13.88 102.95,14.93 1.P$3
  Top 0.254: R15.1 140.28,23.36 v141.83,23.36 | R17.1 135.18,23.36 v136.73,23.36 | R16.1 130.38,23.36 v131.93,23.36 | R18.1 125.08,23.36 v126.73,23.36 | R19.1 120.18,23.36 v121.73,23.36
  Top 0.406: C13.2 142.83,39.41 R11.2 144.83,31.21 C15.+ | U3.2 37.38,51.8
  Top 0.813: 37.38,51.8 35.12,51.8 34.22,52.7 34.22,55.86 35.07,56.71 36.67,56.71 C17.1 36.76,65.74 40.14,69.12 40.14,73.61 POWER.4 | v43.69,47.78 43.63,47.84 U3.4 U3.2 | v145.14,33.25 142.87,33.25 R11.2
  Bottom 0.203: v85.17,11.4 85.19,11.38 85.19,11.36 | v68.24,14.96 68.21,14.96 68.19,14.94
  Bottom 0.254: C15.+ 142.09,23.1 v141.83,23.36
  Bottom 0.813: v43.69,47.78 43.69,45.07 41.13,42.51 41.13,35.81 55.24,21.7 61.43,21.7 68.19,14.94 71.77,11.36 85.19,11.36 v100.75,11.36 142.5,11.36 147.95,16.87 147.95,30.47 145.15,33.27 v145.15,33.26 v145.14,33.25
  pour Bottom: 118.33,24.26 142.66,24.26 142.61,22.29 118.28,22.29
+5V  (via drill 0.4, 0.6)  (1 unrouted)
  Top 0.203: 81.53,60.09 IC3.80 | R3.2 82.28,31 82.33,30.95 | 45.78,62.45 R6.2 | C6.1 68.15,54 68.52,53.63 69.49,53.63 IC3.10 | IC3.31 74,47 v74.33,47 | U1.20 55,22.84 55.61,22.24 56.24,22.24 56.51,21.97 56.51,21.45 C2.1
  Top 0.254: 82.18,34.46 R2.2 | R2.2 R3.2 | R4.2 67.48,34.65 D3.C | R2.2 82.27,34.57 v82.27,36.44 | C4.1 86.83,59.65 C5.1 | 45.78,62.45 45.78,59.75 v45.81,59.72 | IC3.10 74.08,53.62 | 85.49,51.11 84.04,51.11 82.95,52.2 82.95,56.74 82.59,57.1 | 81.53,60.09 81.53,57.38 81.25,57.1 | IC3.100 71.5,58.77 71.84,58.43 73.7,58.43 76.3,55.82
  Top 0.406: v64.1,34.79 66.6,34.79 D3.C | U1.20 55,26.07 58.26,29.33 | 58.26,29.33 U1.4 | 58.26,29.33 62.83,29.33 63.09,29.07 | 66.22,19.23 66.09,19.36 R8.1 R7.1 | 74.08,53.62 74.33,53.37
  Top 0.813: v64.1,34.79 v64.11,34.8 64.11,34.81 63.09,33.79 63.09,29.07 63.09,27.78 66.22,24.65 66.22,19.23 66.22,18.02 64.29,16.09 61.01,16.09 59.05,14.13 | v74.33,47 74.33,53.37 74.33,53.85 76.3,55.82 77.58,57.1 81.25,57.1 82.59,57.1 83.02,57.53 83.02,57.54 85.1,59.62 C5.1 | 59.05,14.13 59.05,6.99 SJ1.2 59.08,5.44 63.54,0.98 140.85,0.98 X1.6 | C8.1 57.33,14.13 59.05,14.13
  Bottom 0.254: v82.27,36.44 74.33,44.38 v74.33,47 | v45.81,59.72 45.8,59.71 45.8,54.88 53.01,47.67 ICSP.2 55.35,46.04 55.35,33.58 57.3,31.63 60.94,31.63 v64.1,34.79
  Bottom 0.813: v64.1,34.79 67.62,38.31 67.62,41.47 73.15,47 v74.33,47
+12V  (via drill 0.6)
  Top 0.813: v35.18,17.48 35.26,17.56 PC1.+ U4.3 31.37,22.75 29.2,24.92 29.2,39.3 | 29.2,39.3 21.99,39.3 L1.P$2 | 29.2,39.3 29.23,39.33 33.44,39.33 37.33,43.22 C16.1 37.43,46.56 U3.3 33.87,49.44 31.75,51.56 31.75,67.17 v34.01,69.43 | POWER.1 47.81,77.06 43.96,80.91 X8.1
  Bottom 0.813: JP3.3 53.23,11.51 47.26,17.48 v35.18,17.48 | v34.01,69.43 45.35,69.43 47.79,71.87 47.79,73.64 POWER.1
  Bottom 1.27: LM2576-12V.P$4 19.81,30.98 19.81,33.75
  pour Bottom: 17.28,35.43 15.92,35.43 6.57,44.78 6.57,49.33 8.17,50.93 13.93,50.93 15.52,49.34 15.52,40.67 19.5,36.69 19.51,36.69 20.25,35.95 20.3,35.95 20.87,35.38 20.95,32.59 20.64,32.14 18.71,32.14 18.1,32.62 18.14,34.57
ADC0
  Top 0.203: IC3.97 73,63.69 69.43,67.26 69.43,72.36 JP1.1
ADC1
  Top 0.203: IC3.96 73.5,64.19 71.83,65.86 71.83,72.32 JP1.3
ADC2
  Top 0.203: IC3.95 74,71.95 JP1.5
ADC3
  Top 0.203: IC3.94 74.5,69.91 JP1.7
ADC4
  Top 0.203: IC3.93 75,67.87 JP1.9
ADC5
  Top 0.203: IC3.92 75.5,67.13 78.83,70.46 80.13,70.46 JP1.11
ADC6
  Top 0.203: IC3.91 76,66.83 79.03,69.86 82.07,69.86 JP1.13
ADC7
  Top 0.203: IC3.90 76.5,66.53 79.23,69.26 84.01,69.26 JP1.15
ADC8
  Top 0.203: IC3.89 77,66.23 79.43,68.66 85.95,68.66 JP1.17
ADC9
  Top 0.203: IC3.88 77.5,65.83 79.63,67.96 87.79,67.96 JP1.19
ADC10
  Top 0.203: IC3.87 78,65.43 79.83,67.26 89.63,67.26 JP1.21
ADC11
  Top 0.203: IC3.86 78.5,65.13 80.03,66.66 91.57,66.66 JP1.23
ADC12
  Top 0.203: IC3.85 79,64.93 80.23,66.16 93.61,66.16 JP1.25
ADC13
  Top 0.203: IC3.84 79.5,64.73 80.33,65.56 95.55,65.56 JP1.27
ADC14
  Top 0.203: IC3.83 80,64.53 80.53,65.06 97.59,65.06 JP1.29
ADC15
  Top 0.203: IC3.82 80.5,64.23 80.83,64.56 99.63,64.56 JP1.31
AREF
  Top 0.203: IC3.98 72.5,62.31 C3.1
D+
  Top 0.203: U1.15 49.77,24.3 45.66,20.19 45.66,16.88 41.46,12.68 41.46,10.46 42.32,9.6 43.06,9.6 X2.3
D-
  Top 0.203: X2.2 46.88,15.42 46.88,19.99 49.43,22.57 49.85,22.99 51.98,22.99 52.4,23.41 U1.16
GND  (via drill 0.4, 0.6)
  other vias: 87.32,51.39 13.96,33.86 13.96,31.86 13.96,29.86 13.96,27.86 13.96,25.86 13.96,23.86 10.96,33.86 10.96,31.86 10.96,29.86 10.96,27.86 10.96,25.86 10.96,23.86 7.96,33.86 7.96,31.86 7.96,29.86 7.96,27.86 7.96,25.86 7.96,23.86 4.96,33.86 4.96,23.86 1.96,33.86 1.96,31.86 1.96,25.86 1.96,23.86 64.8,57.03 82.38,63.54 81.44,62.68 88.98,51.39 91.11,12.58 91.2,14.94 77.16,46.98 79.75,46.98 82.18,46.98 77.22,49.18 79.81,49.18 82.24,49.18 76.43,51.78 79.02,51.78 81.45,51.78 76.37,54.15 78.96,54.15 81.39,54.15 47.71,18.72 68.16,68.06 68.11,69.75 16.45,55.38 19.04,55.38 21.47,55.38 16.51,57.58 19.1,57.58 21.53,57.58 123.82,48.85 126.41,48.85 128.84,48.85 123.88,51.05 126.47,51.05 128.9,51.05 41.99,1.56 44.58,1.56 47.01,1.56 42.05,3.76 44.64,3.76 47.07,3.76 53.39,68.75 55.98,68.75 58.41,68.75 53.45,70.95 56.04,70.95 58.47,70.95 37.55,39.21 39.08,40.97 47.4,33 48.45,31.83
  pour Top: 0.43,89 149.03,89 149.03,-0.09 0.43,-0.09
  pour Bottom: -0.04,88.91 -0.13,-0.12 148.91,-0.12 149,88.91
GND2
  Top 0.203: X1.1 T5.3
IO0  (via drill 0.4)
  Top 0.203: JP1.4 70.28,76.59 68.26,76.59 66.67,75 66.67,59.52 68.57,57.62 IC3.2 71.09,57.62 v71.92,57.58 | U1.1 60.2,32.88 v60.78,33.46
  Bottom 0.203: v60.78,33.46 65.41,38.07 65.41,41.59 72.63,48.86 72.66,56.95 72.09,57.52 v71.92,57.58
IO1  (via drill 0.4)
  Top 0.203: JP1.6 72.25,77.16 68.13,77.16 66.18,75.21 66.18,59.34 68.4,57.12 IC3.3 70.97,57.12 v71.67,56.23 | U1.5 57.6,34.44 v57.08,34.96
  Bottom 0.203: v57.08,34.96 71.66,49.76 v71.67,56.23
IO2
  Top 0.203: IC3.6 68.17,55.62 64.93,58.86 64.93,75.66 67.73,78.46 76.03,78.46 JP1.10
IO3
  Top 0.203: IC3.7 67.97,55.12 64.43,58.66 64.43,75.86 67.53,78.96 78.07,78.96 JP1.12
IO4
  Top 0.203: IC3.1 68.74,58.12 67.22,59.64 67.22,72.79 JP1.2
IO5
  Top 0.203: IC3.5 68.37,56.12 65.43,59.06 65.43,75.46 67.93,77.96 73.99,77.96 JP1.8
IO6
  Top 0.203: IC3.15 64.67,51.12 62.83,52.96 62.83,76.36 66.73,80.26 84.39,80.26 JP1.18
IO7
  Top 0.203: IC3.16 64.47,50.62 62.33,52.76 62.33,76.76 66.33,80.76 86.43,80.76 JP1.20
IO8  (via drill 0.4)
  Top 0.203: IC3.17 63.57,50.12 v63.13,50.56 | X9.3 94.78,75.95 JP1.22
  Bottom 0.203: v63.13,50.56 62.33,51.36 62.33,74.96 63.93,76.56 93.13,76.56 94.74,74.95 JP1.22
IO9  (via drill 0.4)
  Top 0.203: IC3.18 62.57,49.62 v62.03,50.16 | X9.2 97.32,78.41 JP1.24
  Bottom 0.203: v62.03,50.16 61.73,50.46 61.73,75.16 63.73,77.16 95.13,77.16 97.32,74.97 JP1.24
N$1
  Top 0.203: R5.1 55.94,44.15 L.A
N$2
  Top 0.203: R7.2 ON1.A
N$3
  Top 0.203: R6.1 44.11,62.61 44.07,62.65 44.07,65.74 ON.A
N$4
  Top 0.203: R8.2 ON2.A
N$5
  Top 0.203: U1.17 53.05,23.27 52.23,22.45 50.44,22.45 50.13,22.14 50.13,21.45 C7.2
N$6
  Top 0.203: R29.1 54.36,19.55 53.02,18.21 49.96,18.21 48.61,16.86 48.61,15.82 L2.2
  Top 0.813: X2.1 48.58,14.62 L2.2
N$7
  Top 0.203: ON1.C 58.74,21.56 56.96,23.34 U1.23
N$8
  Top 0.203: ON2.C 58.28,19.36 57.64,20 57.64,21.77 56.34,23.07 56.34,24.27 U1.22
N$9
  Top 0.203: U1.3 58.9,36.98 R9.2
N$10
  Top 0.203: U1.2 59.55,36.75 C9.1
N$11
  Top 0.203: U1.11 53.7,33.13 51.88,34.96 47.38,34.96 44.88,37.46 44.88,38.85 JP4.1
N$12
  Top 0.203: U1.10 54.35,33.48 52.18,35.66 48.98,35.66 47.38,37.26 47.38,38.83 JP4.2
N$13
  Top 0.203: U1.9 55,33.73 52.28,36.46 51.48,36.46 49.98,37.96 49.98,38.83 JP4.3
N$14
  Top 0.203: U1.6 56.95,33.58 52.48,38.06 52.48,38.85 JP4.4
N$15
  Top 0.203: U2.3 130.64,41.22 C10.2
N$16
  Top 0.203: U2.1 135.72,41.12 C10.1
N$17
  Top 0.203: U2.5 125.56,42.44 C11.2
N$18
  Top 0.203: U2.4 128.1,42.44 C11.1
N$19
  Top 0.203: U2.6 123.02,42.8 C12.1
N$20
  Top 0.406: U2.16 139.39,31.55 C14.1 R11.1
N$21
  Top 0.203: U2.2 133.18,37.91 134.23,36.86 136.43,36.86 137.73,38.16 137.73,42.81 C13.1
N$22
  Top 0.203: T1.1 140.18,21.46 R15.2
N$23
  Top 0.203: T2.1 130.28,21.56 R16.2
N$24
  Top 0.203: T3.1 135.08,21.56 R17.2
N$25
  Top 0.203: T4.1 125.08,21.56 R18.2
N$26
  Top 0.203: T5.1 120.18,21.56 R19.2
N$27
  Bottom 0.406: LM2576-12V.P$2 26.33,27.46 26.34,27.45 28.01,27.45
  pour Bottom: 26.98,26.98 35.01,26.98 35.01,33.51 27.86,40.66 27.86,49.4 26.81,50.45 23.45,50.45 22.48,49.48 22.48,38.19 26.98,33.69
N$28
  Top 0.254: R21.2 7.2,20.83 D2.A 9.75,20.81 T6.1
N$29
  Top 0.254: D2.C 11.25,16.16 R20.1
N$30
  Top 0.254: R22.2 6.83,18.91 T6.2 13.18,18.16 16.23,18.16 17.33,19.26 17.33,32.16 17.73,32.56 LM2576-12V.P$5
N$31
  Top 0.203: INDLED.2 R5.2
N$32
  Top 0.813: L2.1 52.53,15.74 F1.2
N$33
  Bottom 0.813: JP3.2 82.54,8.97 | 82.54,8.97 97.85,8.97 | 97.85,8.97 110.93,8.97 113.4,6.5 113.4,4.4 X4.3 | X6.3 82.4,8.83 82.54,8.97 | X5.3 97.89,8.93 97.85,8.97
N$34
  Top 0.254: R25.1 86.54,11.55 2.P$4 87.44,12.42 88.68,13.66 98.75,13.66 JP6.1
N$35
  Top 0.254: R23.1 103.9,12.05 1.P$4 104.7,13.56 112.05,13.56 112.42,13.93 JP5.1
N$36
  Top 0.254: JP5.3 R24.2 111.91,10.89 108.31,7.29 108.31,4.35 X4.2
N$37
  Top 0.254: 1.P$1 113.01,12.39 R24.1
N$39
  Top 0.254: JP6.3 98.86,10.73 R26.2 92.89,6.9 X5.2
N$40
  Top 0.203: 2.P$1 96.61,12.42 R26.1
  Top 0.254: 96.81,12.38 R26.1
N$41
  Top 0.203: R30.2 R29.2 | U1.19 54.35,22.72 54.36,22.72 R29.2 | 54.38,21.39 R29.2
N$42
  Top 0.254: R27.1 70.87,12.94 3.P$4 72.15,14.22 83.01,14.22 JP8.1
N$43
  Top 0.254: JP8.3 R28.2 77.4,7.32 X6.2
N$44
  Top 0.254: 3.P$1 80.45,12.97 R28.1
PA0
  Top 0.203: IC3.78 82.5,62.03 84.53,64.06 101.67,64.06 JP1.33
PA1
  Top 0.203: IC3.77 83,61.73 84.83,63.56 103.71,63.56 JP1.35
PA2
  Top 0.203: IC3.76 83.5,61.43 85.03,62.96 105.65,62.96 JP1.37
PA3  (via drill 0.4)
  Top 0.203: IC3.75 92.57,58.12 v92.83,57.86
  Bottom 0.203: JP2.28 74.62,18.5 104.53,18.5 107.93,21.9 107.93,42.76 v92.83,57.86
PA4  (via drill 0.4)
  Top 0.203: IC3.74 91.27,57.62 v91.73,57.16
  Bottom 0.203: JP2.26 71.88,23.7 71.73,23.7 76.23,19.2 104.23,19.2 107.33,22.3 107.33,41.46 91.73,57.06 v91.73,57.16
PA5  (via drill 0.4)
  Top 0.203: IC3.73 90.07,57.12 v90.73,56.46
  Bottom 0.203: JP2.24 78.3,19.9 103.73,19.9 106.53,22.7 106.53,22.9 106.63,23 106.63,40.66 90.83,56.46 v90.73,56.46
PA6  (via drill 0.4)
  Top 0.203: IC3.72 88.97,56.62 v89.73,55.86
  Bottom 0.203: JP2.22 80.04,20.7 103.53,20.7 105.93,23.1 105.93,39.46 89.73,55.66 v89.73,55.86
PA7  (via drill 0.4)
  Top 0.203: IC3.71 87.77,56.12 v88.63,55.26
  Bottom 0.203: v88.63,55.26 105.23,38.66 105.23,23.3 103.43,21.5 81.83,21.5 79.59,23.74 JP2.20
PB0  (via drill 0.4)
  Top 0.203: IC3.19 61.47,49.12 v60.93,49.66 | X9.1 99.86,80.87 JP1.26
  Bottom 0.203: v60.93,49.66 60.93,75.26 63.33,77.66 97.13,77.66 99.84,74.95 JP1.26
PB1
  Top 0.203: IC3.20 58.43,48.62 56.87,50.18 56.29,50.18 ICSP.3 | X10.3 102.4,84.2 JP1.28
  Bottom 0.203: JP1.28 99.09,78.26 62.93,78.26 60.23,75.56 60.23,51.56 58.88,50.21 ICSP.3
PB2
  Top 0.203: IC3.21 57.73,48.12 56.93,48.92 54.45,48.92 53.74,49.63 53.74,50.19 ICSP.4 | X10.2 104.94,81.74 JP1.30
  Bottom 0.203: JP1.30 101.13,78.76 62.53,78.76 59.53,75.76 59.53,51.96 59.03,51.46 55.03,51.46 53.78,50.21 ICSP.4
PB3
  Top 0.203: IC3.22 56.31,47.62 ICSP.1 | X10.1 107.48,79.28 JP1.32
  Bottom 0.203: JP1.32 103.17,79.26 62.23,79.26 58.93,75.96 58.93,60.76 54.43,56.26 53.33,56.26 51.63,54.56 51.63,50.16 52.93,48.86 55.03,48.86 56.22,47.67 ICSP.1
PB4  (via drill 0.4)
  Top 0.203: IC3.23 61.49,47.12 v61.03,46.66 | X11.3 115.51,80.23 113.13,80.23 110.02,77.12 JP1.34
  Bottom 0.203: v61.03,46.66 68.13,53.76 68.13,61.16 76.83,69.86 106.93,69.86 108.63,71.56 108.63,73.56 JP1.34
PB5  (via drill 0.4)
  Top 0.203: IC3.24 62.89,46.62 v62.23,45.96 | JP1.36 118.27,80.66 120.88,80.66 125.11,84.89 X11.2
  Bottom 0.203: v62.23,45.96 68.93,52.66 68.93,60.96 77.23,69.26 109.33,69.26 111.33,71.26 111.33,73.66 112.56,74.89 JP1.36
PB6  (via drill 0.4)
  Top 0.203: IC3.25 64.29,46.12 v63.73,45.56 | X11.1 120.23,74.95 JP1.38
  Bottom 0.203: v63.73,45.56 69.63,51.46 69.63,60.56 77.63,68.56 111.73,68.56 113.73,70.56 113.73,73.56 115.1,74.93 JP1.38
PB7  (via drill 0.4)
  Top 0.203: v77.58,36.74 78.34,35.98 78.34,33.83 72.56,28.05 71.13,28.05 69.38,26.3 JP2.27 | INDLED.1 IC3.26 v71.5,42.61
  Bottom 0.203: v71.5,42.61 72.96,42.63 77.58,38.01 v77.58,36.74
PC0
  Top 0.203: IC3.53 87.57,47.12 99.83,34.86 99.83,26.31 JP2.3
PC1
  Top 0.203: JP2.1 102.4,33.19 87.93,47.66 85.54,47.66 IC3.54
PC2
  Top 0.203: JP2.2 103.83,25.17 103.83,32.66 88.37,48.12 IC3.55
PC3
  Top 0.203: JP2.4 101.3,22.3 103.33,22.3 104.53,23.5 104.53,33.06 88.97,48.62 IC3.56
PC4
  Top 0.203: IC3.57 89.37,49.12 105.23,33.26 105.23,23.3 103.43,21.5 99.56,21.5 JP2.6
PC5
  Top 0.203: IC3.58 89.87,49.62 105.93,33.56 105.93,23.1 103.53,20.7 97.82,20.7 JP2.8
PC6
  Top 0.203: IC3.59 90.37,50.12 106.63,33.86 106.63,22.7 103.83,19.9 96.08,19.9 JP2.10
PC7
  Top 0.203: IC3.60 90.97,50.62 107.33,34.26 107.33,22.3 104.23,19.2 94.24,19.2 JP2.12
PD7
  Top 0.203: IC3.50 83.5,42.59 92.23,33.86 92.23,26.29 JP2.9
PG0
  Top 0.203: IC3.51 85.5,42.19 94.73,32.96 94.73,26.33 JP2.7
PG1
  Top 0.203: IC3.52 87.17,46.62 97.43,36.36 97.43,26.39 JP2.5
PG2  (via drill 0.4)
  Top 0.203: IC3.70 86.67,55.62 v87.53,54.76
  Bottom 0.203: v87.53,54.76 104.53,37.76 104.53,23.5 103.33,22.3 83.53,22.3 JP2.18
PL2
  Top 0.203: IC3.37 77,40.42 79.09,38.33 79.09,33.45 JP2.25 70.71,25.07 70.71,18.42 72.5,16.63 80.09,16.63 81.23,15.49 84.05,15.49 84.83,14.71 84.83,13.03 84.15,12.35 JP8.2
PL3
  Top 0.203: IC3.38 77.5,40.69 79.63,38.56 79.63,31.45 JP2.23 74.46,26.24 73.2,24.98 73.2,18.49 74.34,17.35 80.3,17.35 81.62,16.03 100.42,16.03 100.89,15.56 100.89,13.01 100.27,12.39 JP6.2
PL4
  Top 0.203: IC3.39 78,41.09 80.33,38.76 80.33,29.61 JP2.21 75.7,24.98 75.7,19.7 75.77,19.63 75.81,19.63 75.91,19.53 75.91,19.49 77.2,18.17 80.48,18.17 82.05,16.6 115.55,16.6 117.58,14.57 117.58,13.21 116.78,12.41 JP5.2
PL5
  Top 0.203: IC3.40 78.5,41.39 78.6,41.39 80.93,39.06 80.93,27.67 JP2.19
R1IN
  Top 0.203: R13.1 117.94,42.62 U2.8 117.94,37.05 121.73,33.26 121.73,24.96 123.13,23.56 123.13,19.51 T4.2
R1IN_
  Top 0.203: X1.2 124.23,17.16 T4.3
R1OUT
  Top 0.203: JP7.8 U2.9
R2IN
  Top 0.203: U2.13 128.08,31.53 R14.1 128.08,19.66 T2.2
R2IN_
  Top 0.203: X1.3 129.23,17.06 T2.3
R2OUT
  Bottom 0.203: JP7.6 115,34.09 116.03,33.06 116.03,30.06 117.23,28.86 124.63,28.86 125.53,29.76 125.53,31.52 U2.12
REG_5V  (via drill 0.6)
  Top 0.254: C18.2 48.22,69.27 48.36,69.41
  Top 0.813: v46.65,24.78 46.37,25.06 U4.4 U4.2 37.97,25.04 36.3,25.04 34.74,26.6 34.74,30.05 37.05,32.36 PC2.+ 37.99,35.51 43.94,41.46 46.48,41.46 48.56,43.54 48.56,69.21 48.36,69.41 45.29,72.48 45.29,73.64 POWER.2 45.04,73.89 45.04,75.61 43.89,76.76 38.83,76.76 37.65,75.58 POWER.5 | SJ1.3 61.43,7.15 v61.43,14.1
  Bottom 0.813: v46.65,24.78 46.65,21.47 54.01,14.1 v61.43,14.1
RESET  (via drill 0.6)
  Top 0.203: S1.1 71.08,30.51 69.93,31.46 69.93,33.7 D3.A 70.01,37.24 | 52.67,55.45 50.43,53.21 50.43,44.06 52.83,41.66 57.99,41.66 68.93,41.66 69.19,41.4 C1.1 69.18,40.4 R4.1 69.28,37.26 69.99,37.26 70.01,37.24 | 52.67,55.45 54.83,55.45 56.28,54 56.28,52.77 ICSP.5 | 70.01,37.24 73.5,40.73 IC3.30 | v52.7,59.3 52.7,55.48 52.67,55.45
  Top 0.254: 57.99,41.66 R9.1 58.02,39.65 C9.2 | POWER.3 42.73,67.37 41.4,66.04 41.4,66.03 v41.38,66.01
  Bottom 0.254: v41.38,66.01 41.38,63.57 43.23,61.72 50.32,61.72 52.71,59.33 52.7,59.32 v52.7,59.3
RXD1
  Top 0.203: IC3.45 81,42.69 87.23,36.46 87.23,26.35 JP2.13 85.88,25 84.03,25 83.33,24.3 83.33,20.4 86.41,17.27 105.9,17.27 112.43,23.8 112.43,32.86 111.2,34.09 JP7.5
RXD2
  Top 0.203: IC3.12 64.97,52.62 63.93,53.66 63.93,76.06 67.23,79.36 80.21,79.36 JP1.14
RXD3
  Top 0.203: JP2.14 92.4,18.5 104.53,18.5 107.93,21.9 107.93,34.66 | 107.93,34.66 90.47,52.12 IC3.63 | 107.93,34.66 110.53,32.06 110.65,32.06 JP7.7
SCL  (via drill 0.4)
  Top 0.203: 84.01,34.59 R2.1 | R2.1 84.1,34.68 85.01,34.68 v85.03,34.66 | IC3.43 80,41.79 84.03,37.76 84.03,34.61 R2.1
  Bottom 0.203: v85.03,34.66 85.03,29.23 JP2.17
SDA
  Top 0.203: R3.1 84.03,31.31 84.28,31.06 86.53,31.06 | IC3.44 80.5,42.19 86.53,36.16 86.53,31.06 | 86.53,31.06 86.53,28.19 JP2.15 84.62,26.39
T1IN
  Top 0.203: R10.1 U2.10 120.48,32.71 116.53,36.66 113.73,36.66 JP7.4
T1OUT
  Top 0.203: U2.7 120.48,37.71 121.83,36.36 126.03,36.36 129.33,33.06 129.33,30.16 133.13,26.36 133.13,19.41 T3.2
T1OUT_
  Top 0.203: X1.4 134.23,17.06 T3.3
T2IN
  Top 0.203: R12.1 122.98,31.51 U2.11
  Bottom 0.203: JP7.2 114.82,39.17 118.83,35.16 120.93,35.16 123.03,33.06 U2.11
T2OUT
  Top 0.203: U2.14 130.64,30.85 132.43,29.06 135.63,29.06 138.33,26.36 138.33,19.51 T1.2
T2OUT_
  Top 0.203: X1.5 T1.3
TXD1  (1 unrouted)
  Top 0.203: IC3.46 81.5,42.89 89.83,34.56 89.83,26.41
  Bottom 0.203: JP2.11 88.42,25 68.73,25 68.13,24.4 68.13,20.9 71.32,17.82 106.44,17.82 112.43,23.8 112.43,37.96 111.22,39.17 JP7.1
TXD2
  Top 0.203: IC3.13 64.67,52.12 63.43,53.36 63.43,76.26 66.93,79.76 82.35,79.76 JP1.16
TXD3  (via drill 0.4)
  Top 0.203: IC3.64 90.87,52.62 106.73,36.66 111.13,36.66 JP7.3 | v109.13,22 104.83,17.8 90.56,17.8 JP2.16
  Bottom 0.203: v109.13,22 109.13,34.6 JP7.3
VIN  (via drill 0.4)
  Top 0.254: T6.3 v16.13,19.86 | X3.2 14.58,16.03 R20.2
  Top 0.813: LM2576-12V.P$1 25.11,25.76 27.13,27.78 27.13,33.41 23.47,37.07 16.38,37.07 10.98,42.47 10.98,68.47 16.23,73.72 29.97,73.72 | 29.97,73.72 POWER.8 | 29.97,73.72 29.97,80.56 X8.3
  Bottom 0.813: JP3.1 55.25,6.43 47.41,14.27 20.97,14.27
  pour Bottom: 21.93,26.86 25.43,26.86 25.43,14.96 25.38,11.33 22.05,7.46 14.34,7.44 9.57,1.77 6.07,1.77 6.03,6.46 6.03,10.96
VUSB
  Top 0.813: SJ1.1 56.54,11.57 | 56.54,11.57 F1.1 | 56.54,11.57 56.59,11.62
XTAL1
  Top 0.203: R1.1 76.18,35.85 Y1.3 76.14,38.43 76.14,39.78 75.5,40.42 IC3.34
XTAL2
  Top 0.203: R1.2 74.18,35.75 Y1.1 74.21,38.42 74.21,39.6 75,40.39 IC3.33

### Text on the board
tPlace: TX2 | 5V | GND | TX1 | RX1 | RX2
tNames: VIN | 12V | TXD1 | 2 | TXD3 | 1 | RXD1 | RXD3 | _ | _ | _ | sig | + | sig | + | sig | + | OC3 | OC2 | OC1 | _ | + | 12V | VIN | USB | REG | 47 | 46 | 45